# Altium project Cubli.PrjPcb (part 1 of 2)
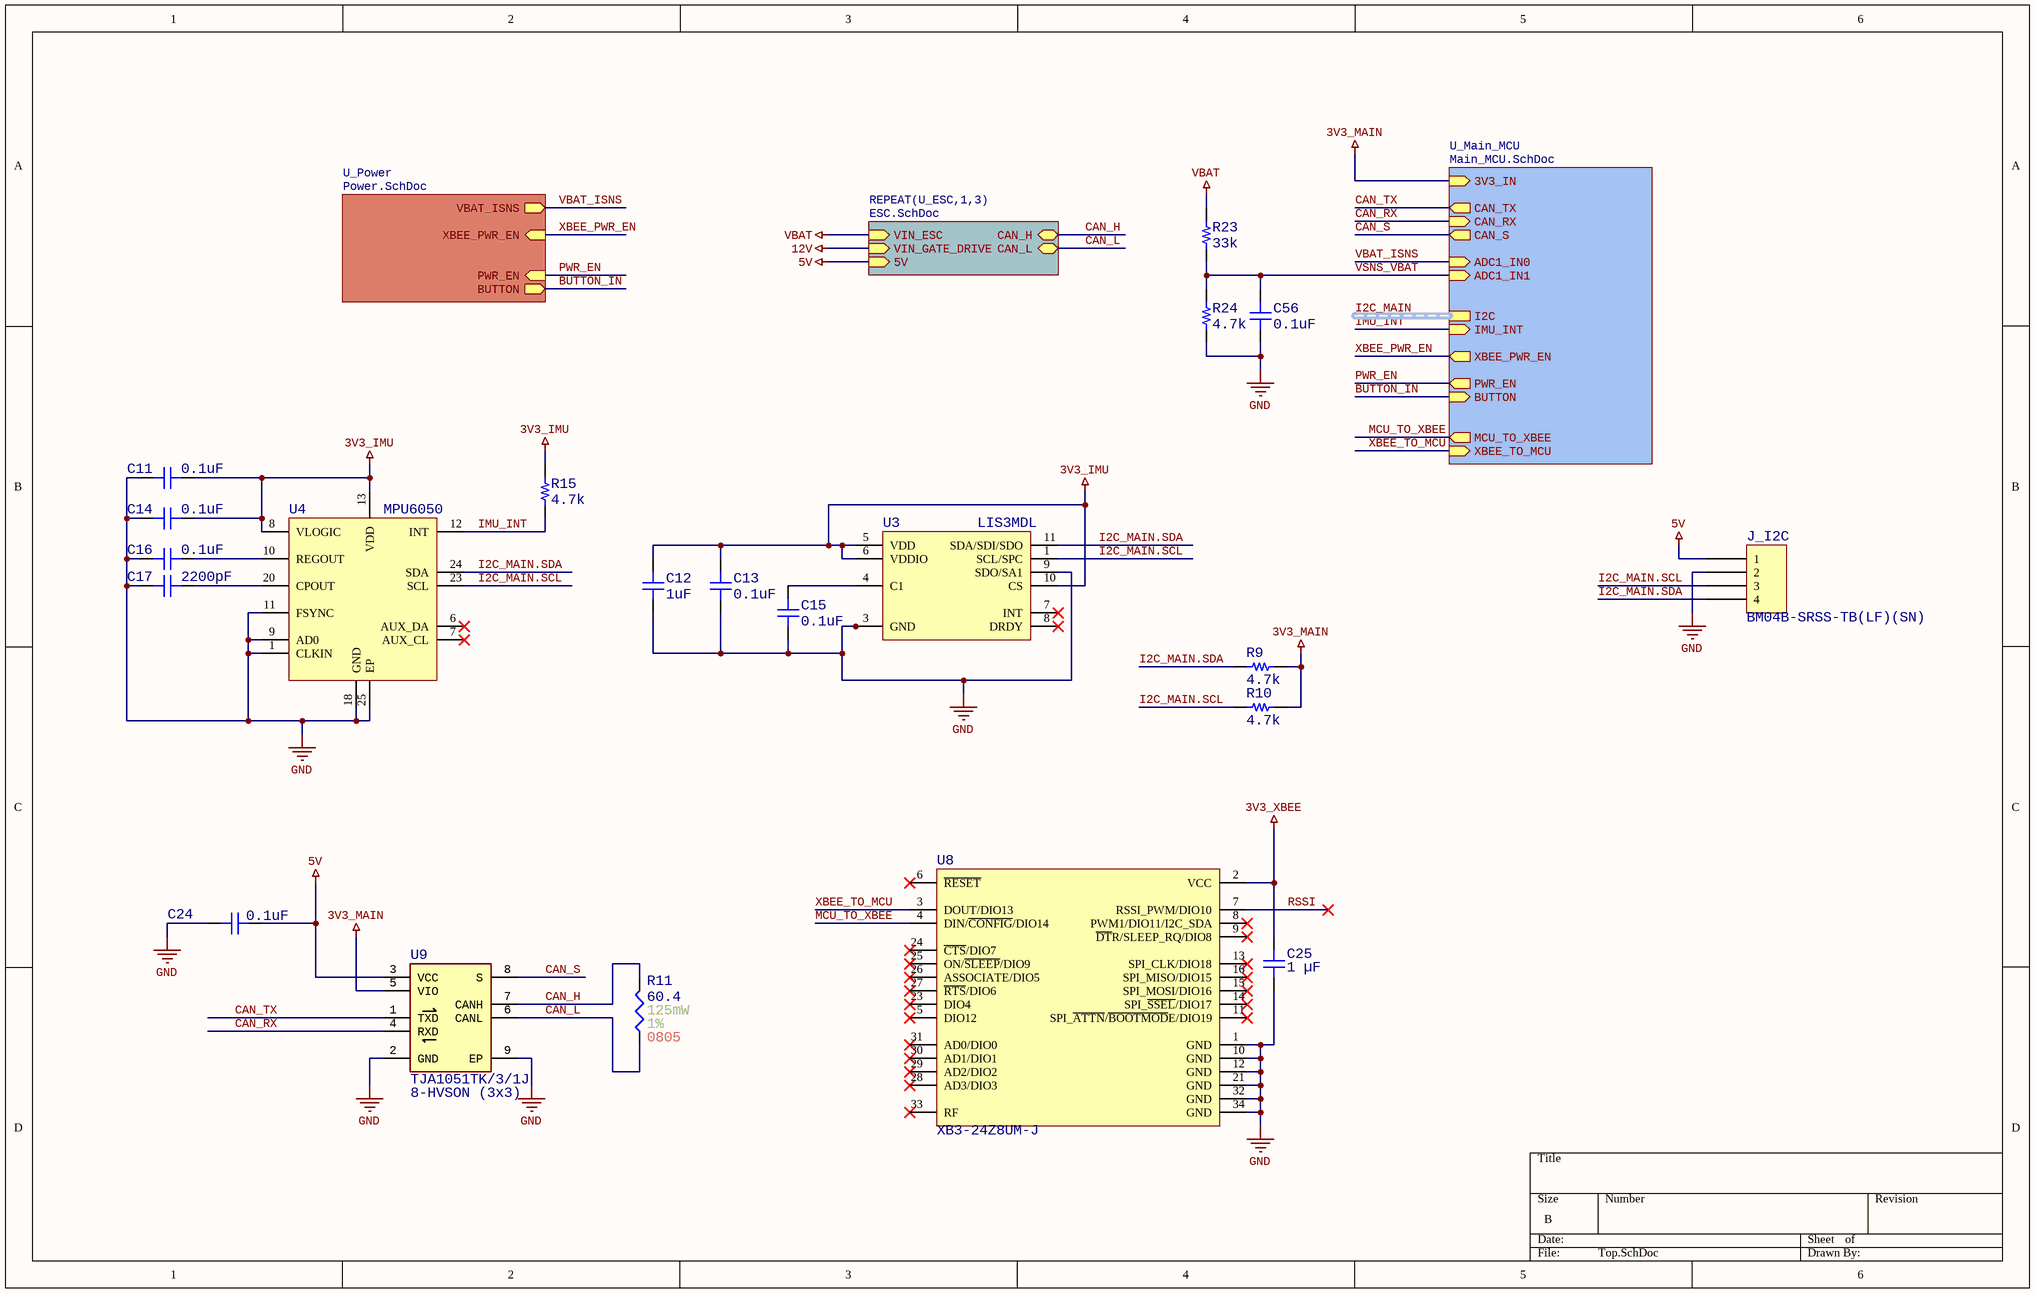
[diagram p0: Top.SchDoc]
Project: Cubli; ProjectRevision: 3.1
7 sheets, 473 parts. Net scope: hierarchical (ports join the sheet entries above them; power ports are global).
Board file: Cubli.PcbDoc
Sheets:
  Top.SchDoc
    U_ESC1 = ESC.SchDoc
      U_ESC_MCU = ESC_MCU.SchDoc
      U_Power = ESC_Power.SchDoc
      U_Half_Bridges = Half_Bridges.SchDoc
    U_ESC2 = ESC.SchDoc
      U_ESC_MCU = ESC_MCU.SchDoc
      U_Power = ESC_Power.SchDoc
      U_Half_Bridges = Half_Bridges.SchDoc
    U_ESC3 = ESC.SchDoc
      U_ESC_MCU = ESC_MCU.SchDoc
      U_Power = ESC_Power.SchDoc
      U_Half_Bridges = Half_Bridges.SchDoc
    U_Main_MCU = Main_MCU.SchDoc
    U_Power = Power.SchDoc

## Sheet Top.SchDoc
size B; SheetNumber: 1; SheetTotal: 7

### Parts
C11  0.1uF  [CAP_0402]
C12  1uF  [CAP_0402]
C13  0.1uF  [CAP_0402]
C14  0.1uF  [CAP_0402]
C15  0.1uF  [CAP_0402]
C16  0.1uF  [CAP_0402]
C17  2200pF  [CAP_0402]
C24  0.1uF  [CAP_0402]
C25  1 µF  [CAP 0402_1005]
C56  0.1uF  [CAP_0402]
J_I2C  BM04B-SRSS-TB(LF)(SN)  [JST BM04B-SRSS-TB]
R9  4.7k  [RES_0402]
R10  4.7k  [RES_0402]
R11  value 60.4  Power: 125mW  Tolerance: 1%  Case/Package: 0805  [0805 Resistor]  (hidden comment: TFA0805R60R4F-T5)
R15  4.7k  [RES_0402]
R23  33k  [RES_0402]
R24  4.7k  [RES_0402]
U3  LIS3MDL  [LGA12_ST]
U4  MPU6050  [IC_MPU6050]
U8  XB3-24Z8UM-J  [XCVR_XB3-24Z8UM-J]
U9  TJA1051TK/3/1J  Case/Package: 8-HVSON (3x3)  [TJA1044xxK]

### Sub-sheets
REPEAT(U_ESC,1,3) = ESC.SchDoc: CAN_H (bidir), CAN_L (bidir), VIN_ESC (in), VIN_GATE_DRIVE (in), 5V (in)
U_Main_MCU = Main_MCU.SchDoc: I2C (harness I2C), CAN_TX (out), CAN_RX (in), CAN_S (out), 3V3_IN (in), ADC1_IN0 (in), IMU_INT (in), XBEE_PWR_EN (out), PWR_EN (out), BUTTON (in), XBEE_TO_MCU (in), MCU_TO_XBEE (out), ADC1_IN1 (in)
U_Power = Power.SchDoc: XBEE_PWR_EN (in), VBAT_ISNS (out), PWR_EN (in), BUTTON (out)

### Nets
3V3_IMU: C11.1 C12.1 C13.1 C14.1 R15.1 U3.5(VDD) U3.6(VDDIO) U3.10(CS) U4.8(VLOGIC) U4.13(VDD)
3V3_MAIN: R9.1 R10.1 U9.5(VIO) ; sheet U_Main_MCU/3V3_IN
3V3_XBEE: C25.1 U8.2(VCC)
5V: C24.1 J_I2C.1 U9.3(VCC) ; sheet REPEAT(U_ESC,1,3)/5V
GND: C11.2 C12.2 C13.2 C14.2 C15.2 C16.2 C17.2 C24.2 C25.2 C56.2 J_I2C.2 R24.2 U3.2(Reserved) U3.3(GND) U3.9(SDO/SA1) U3.12(Reserved) U4.1(CLKIN) U4.9(AD0) U4.11(FSYNC) U4.18(GND) U4.25(EP) U8.1(GND) U8.10(GND) U8.12(GND) U8.21(GND) U8.32(GND) U8.34(GND) U9.2(GND) U9.9(EP)
VBAT: R23.1 ; sheet REPEAT(U_ESC,1,3)/VIN_ESC
BUTTON_IN: sheet U_Main_MCU/BUTTON, sheet U_Power/BUTTON
CAN_H: R11.2 U9.7(CANH) ; sheet REPEAT(U_ESC,1,3)/CAN_H
CAN_L: R11.1 U9.6(CANL) ; sheet REPEAT(U_ESC,1,3)/CAN_L
CAN_RX: U9.4(RXD) ; sheet U_Main_MCU/CAN_RX
CAN_S: U9.8(S) ; sheet U_Main_MCU/CAN_S
CAN_TX: U9.1(TXD) ; sheet U_Main_MCU/CAN_TX
I2C_MAIN.SCL: J_I2C.3 R10.2 U3.1(SCL/SPC) U4.23(SCL)
I2C_MAIN.SDA: J_I2C.4 R9.2 U3.11(SDA/SDI/SDO) U4.24(SDA)
IMU_INT: R15.2 U4.12(INT) ; sheet U_Main_MCU/IMU_INT
MCU_TO_XBEE: U8.4(DIN/~{CONFIG}/DIO14) ; sheet U_Main_MCU/MCU_TO_XBEE
PWR_EN: sheet U_Main_MCU/PWR_EN, sheet U_Power/PWR_EN
RSSI: U8.7(RSSI_PWM/DIO10)
VBAT_ISNS: sheet U_Main_MCU/ADC1_IN0, sheet U_Power/VBAT_ISNS
VSNS_VBAT: C56.1 R23.2 R24.1 ; sheet U_Main_MCU/ADC1_IN1
XBEE_PWR_EN: sheet U_Main_MCU/XBEE_PWR_EN, sheet U_Power/XBEE_PWR_EN
XBEE_TO_MCU: U8.3(DOUT/DIO13) ; sheet U_Main_MCU/XBEE_TO_MCU
NetC15_1: C15.1 U3.4(C1)
NetC16_1: C16.1 U4.10(REGOUT)
NetC17_1: C17.1 U4.20(CPOUT)

Not connected (* = marked no-connect by the designer): U3 7(INT)* 8(DRDY)*; U4 6(AUX_DA)* 7(AUX_CL)*; U8 5(DIO12)* 6(~{RESET})* 8(PWM1/DIO11/I2C_SDA)* 9(~{DT}R/SLEEP_RQ/DIO8)* 11(SPI_~{ATTN}/~{BOOTMOD}E/DIO19)* 13(SPI_CLK/DIO18)* 14(SPI_~{SSEL}/DIO17)* 15(SPI_MOSI/DIO16)* 16(SPI_MISO/DIO15)* 23(DIO4)* 24(~{CTS}/DIO7)* 25(ON/~{SLEEP}/DIO9)* 26(ASSOCIATE/DIO5)* 27(~{RTS}/DIO6)* 28(AD3/DIO3)* 29(AD2/DIO2)* 30(AD1/DIO1)* 31(AD0/DIO0)* 33(RF)*

### Buses and harness runs
harness I2C_MAIN = sheet U_Main_MCU/I2C

### Library data of the parts
C11-C17 C24 C56 = CAP_0402: CAP CER 402
  C11 C13-C16 C24 C56: Value: 0.1uF
  C12: Value: 1uF
  C17: Value: 2200pF
C25 = C0402C104K4RACAUTO: CAP CER 0.1UF 16V X7R 0402; manufacturer: KEMET; Capacitance: 0.1 µF; Tolerance: ±10%; Part Number: C0402C104K4RACAUTO; Value: 1 µF; Applications: Automotive, Bypass, Decoupling; componentlink1description: Datasheet; componentlink1url: https://api.kemet.com/component-edge/download/specsheet/C0402C104K4RACAUTO.pdf; componentlink2description: DigiKey Link; componentlink2url: https://www.digikey.com/en/products/detail/kemet/C0402C104K4RACAUTO/3314827; Device Package: 0402 (1005 Metric); lastupdated: 8/14/2022 9:05:51 PM; Lifecycle Status: Active; Minimum Order: 1; Mounting Type: Surface Mount, MLCC; Operating Temperature: -55°C ~ 125°C; Package / Case: 0402 (1005 Metric); packaging: TapeAndReel; partid: 3024; Part Status: Active; price: 0.01; Ratings: AEC-Q200; series: SMD Auto X7R; Size / Dimension: 0.039" L x 0.020" W (1.00mm x 0.50mm); Supplier 1: DigiKey; Supplier Part Number 1: 399-6828-1-ND; Temperature Coefficient: X7R; Thickness (Max): 0.022" (0.55mm); Voltage - Rated: 16V
J_I2C = BM04B-SRSS-TB(LF)(SN): CONN HEADER SMD 4POS 1MM; Manufacturer: JST Sales America Inc.; Current Rating (Amps): 0.7A; Material Flammability Rating: UL94 V-0; Number of Positions: 4; Number of Positions Loaded: All; Pitch - Mating: 0.039" (1.00mm); Row Spacing - Mating: -25°C ~ 85°C; Shrouding: Shrouded - 4 Wall; Style: Board to Cable/Wire; Voltage Rating: 50V; Part Number: BM04B-SRSS-TB(LF)(SN); ComponentLink1Description: Datasheet; ComponentLink1URL: http://www.jst-mfg.com/product/pdf/eng/eSH.pdf; ComponentLink2Description: DigiKey Link; ComponentLink2URL: http://digikey.com/product-detail/en/jst-sales-america-inc/BM04B-SRSS-TB-LF-SN/455-1790-1-ND/926861; Connector Type: Header; Contact Finish - Mating: Tin; Contact Finish - Post: Tin; Contact Material: Copper Alloy; Contact Shape: Square; Contact Type: Male Pin; Fastening Type: Push-Pull; Features: Solder Retention; Insulation Color: Natural; Insulation Height: 0.167" (4.25mm); Insulation Material: Polyamide (PA), Nylon; LastUpdated: 8/24/2020 1:45:53 PM; Lifecycle Status: Active; Minimum Order: 1; Mounting Type: Surface Mount; Number of Rows: 1; Operating Temperature: -25°C ~ 85°C; Packaging: TapeAndReel; PartId: 16; Part Status: Active; Price: 0.29; Series: SR; Supplier 1: DigiKey; Supplier Part Number 1: 455-1790-1-ND; Termination: Solder
R9 R10 R15 R23 R24 = RES_0402: RES 0402
R11 = CMP-009-00189-2: Res 60.4 Ohm 1% 1/8W 0805; AECQ: Yes; Manufacturer Part Number: TFA0805R60R4F-T5; Mounting Technology: SMD; Pins: 2
U3 = LIS3MDL: Magnetometer
U8 = XB3-24Z8UM-J: 802.15.4 Zigbee Transceiver Module 2.4GHz Antenna Not Included, U.FL Surface Mount; MF: Digi International; Availability: Unavailable; MP: XB3-24Z8UM-J; Value: *; SnapEDA_Link: https://www.snapeda.com/parts/XB3-24Z8UM-J/Digi%20International/view-part/2762908/?ref=snap; Price: None; Package: SMD-34 Digi International
U9 = CMP-031-00007-3: Interface Circuit, PDSO8; AECQ: Yes; Max Operating Temperature: 150°C; Pins: 8; Min Operating Temperature: -40°C

## Sheet ESC.SchDoc
size B; DocumentNumber: 5; Revision: 1.1; SheetNumber: 4; SheetTotal: 7
Used 3 times, as channels U_ESC1, U_ESC2, U_ESC3. Parts and nets are listed once, with the designators drawn on the sheet.
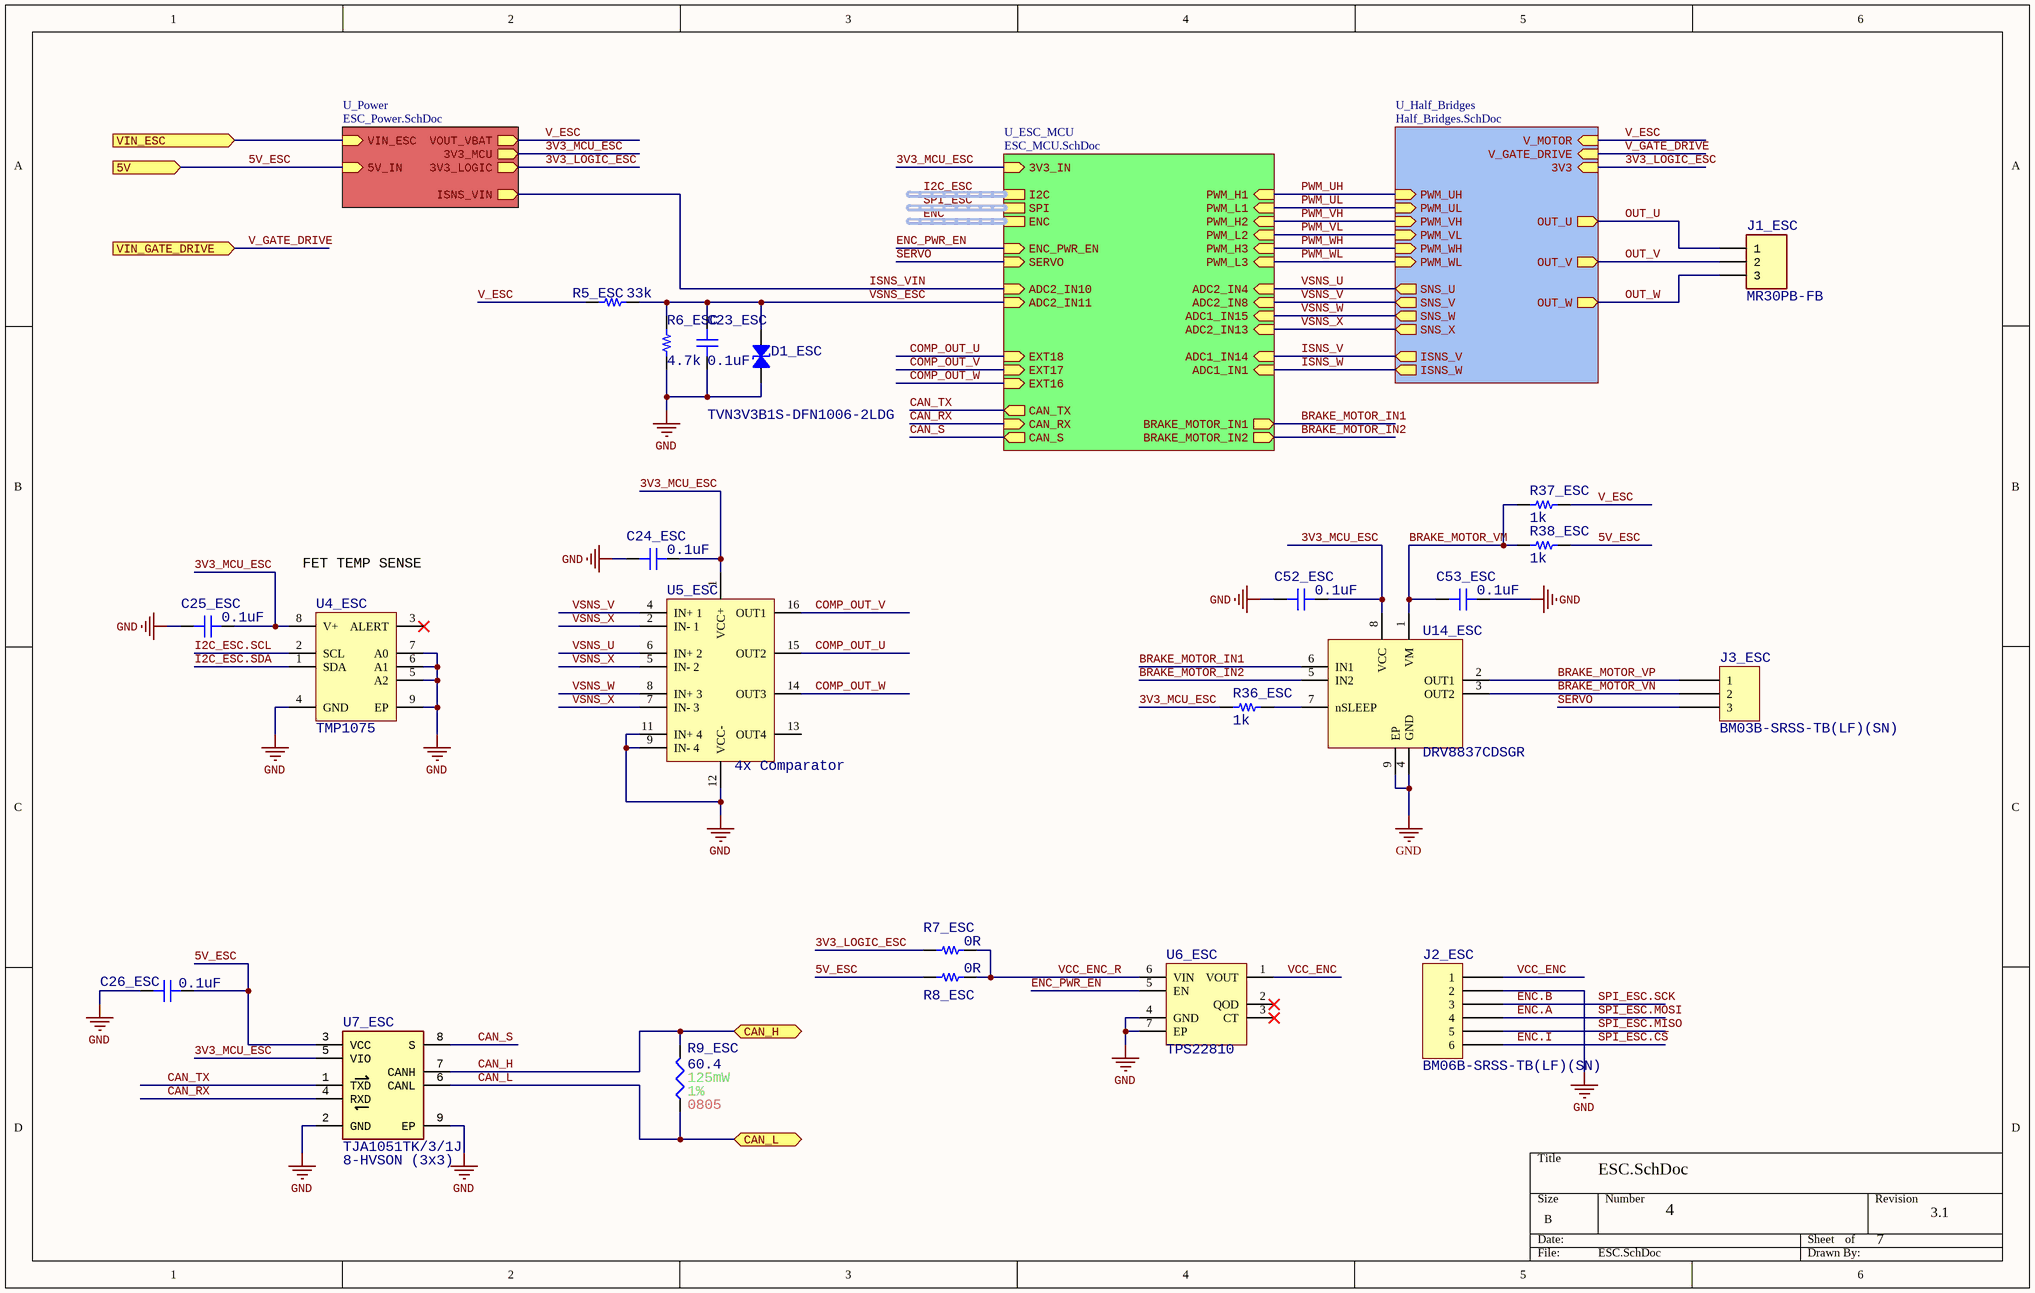
[diagram p1: ESC.SchDoc]

### Parts
C23_ESC  0.1uF  [CAP_0402]
C24_ESC  0.1uF  [CAP_0402]
C25_ESC  0.1uF  [CAP_0402]
C26_ESC  0.1uF  [CAP_0402]
C52_ESC  0.1uF  [CAP_0402]
C53_ESC  0.1uF  [CAP_0402]
D1_ESC  TVN3V3B1S-DFN1006-2LDG  [0402]
J1_ESC  MR30PB-FB  [MR30PB-F]
J2_ESC  BM06B-SRSS-TB(LF)(SN)  [JST BM06B-SRSS-TB]
J3_ESC  BM03B-SRSS-TB(LF)(SN)  [JST BM03B-SRSS-TB]
R5_ESC  33k  [RES_0402]
R6_ESC  4.7k  [RES_0402]
R7_ESC  0R  [RES_0402]
R8_ESC  0R  [RES_0402]
R9_ESC  value 60.4  Power: 125mW  Tolerance: 1%  Case/Package: 0805  [0805 Resistor]  (hidden comment: TFA0805R60R4F-T5)
R36_ESC  1k  [RES_0402]
R37_ESC  1k  [RES_0402]
R38_ESC  1k  [RES_0402]
U4_ESC  TMP1075  [8-WSON_2x2_0.5mm]
U5_ESC  4x Comparator  [QFN50P300X300X100-16N]
U6_ESC  TPS22810  [6-WSON_2x2_0.65mm]
U7_ESC  TJA1051TK/3/1J  Case/Package: 8-HVSON (3x3)  [TJA1044xxK]
U14_ESC  DRV8837CDSGR  [SON50P200X200X80-9N]

### Sub-sheets
U_ESC_MCU = ESC_MCU.SchDoc: I2C (harness I2C), PWM_L1 (in), PWM_H1 (in), PWM_L2 (in), PWM_H2 (in), PWM_L3 (in), PWM_H3 (in), ENC (harness ENC), ADC1_IN1 (in), ADC1_IN14 (in), EXT16 (in), EXT17 (in), EXT18 (in), ADC2_IN10 (in), SPI (harness SPI), ENC_PWR_EN (in), ADC2_IN11 (in), ADC2_IN4 (in), ADC2_IN8 (in), ADC2_IN13 (in), ADC1_IN15 (in), SERVO (in), CAN_TX (out), CAN_RX (in), CAN_S (out), 3V3_IN (in), BRAKE_MOTOR_IN1 (out), BRAKE_MOTOR_IN2 (out)
U_Half_Bridges = Half_Bridges.SchDoc: PWM_UH (in), PWM_UL (in), PWM_VH (in), PWM_VL (in), PWM_WH (in), PWM_WL (in), SNS_U (out), SNS_V (out), SNS_W (out), SNS_X (out), OUT_U (out), OUT_V (out), OUT_W (out), ISNS_V (out), ISNS_W (out), V_MOTOR (in), V_GATE_DRIVE (in), 3V3 (in)
U_Power = ESC_Power.SchDoc: ISNS_VIN (out), VIN_ESC (in), VOUT_VBAT (out), 5V_IN (in), 3V3_MCU (out), 3V3_LOGIC (out)

### Ports
5V (in), CAN_H (bidir), CAN_L (bidir), VIN_ESC (in), VIN_GATE_DRIVE (in)

### Nets
GND: C23_ESC.1 C24_ESC.1 C25_ESC.1 C26_ESC.2 C52_ESC.1 C53_ESC.2 D1_ESC.1 J2_ESC.2 R6_ESC.2 U4_ESC.4(GND) U4_ESC.5(A2) U4_ESC.6(A1) U4_ESC.7(A0) U4_ESC.9(EP) U5_ESC.9(IN-_4) U5_ESC.11(IN+_4) U5_ESC.12(VCC-) U6_ESC.4(GND) U6_ESC.7(EP) U7_ESC.2(GND) U7_ESC.9(EP) U14_ESC.4(GND) U14_ESC.9(EP)
3V3_LOGIC_ESC: R7_ESC.2 ; sheet U_Power/3V3_LOGIC, sheet U_Half_Bridges/3V3
3V3_MCU_ESC: C24_ESC.2 C25_ESC.2 C52_ESC.2 R36_ESC.1 U4_ESC.8(V+) U5_ESC.1(VCC+) U7_ESC.5(VIO) U14_ESC.8(VCC) ; sheet U_ESC_MCU/3V3_IN, sheet U_Power/3V3_MCU
5V_ESC: C26_ESC.1 R8_ESC.2 R38_ESC.2 U7_ESC.3(VCC) ; port 5V, sheet U_Power/5V_IN
BRAKE_MOTOR_IN1: U14_ESC.6(IN1) ; sheet U_ESC_MCU/BRAKE_MOTOR_IN1
BRAKE_MOTOR_IN2: U14_ESC.5(IN2) ; sheet U_ESC_MCU/BRAKE_MOTOR_IN2
BRAKE_MOTOR_VM: C53_ESC.1 R37_ESC.1 R38_ESC.1 U14_ESC.1(VM)
BRAKE_MOTOR_VN: J3_ESC.2 U14_ESC.3(OUT2)
BRAKE_MOTOR_VP: J3_ESC.1 U14_ESC.2(OUT1)
CAN_H: R9_ESC.2 U7_ESC.7(CANH) ; port CAN_H
CAN_L: R9_ESC.1 U7_ESC.6(CANL) ; port CAN_L
CAN_RX: U7_ESC.4(RXD) ; sheet U_ESC_MCU/CAN_RX
CAN_S: U7_ESC.8(S) ; sheet U_ESC_MCU/CAN_S
CAN_TX: U7_ESC.1(TXD) ; sheet U_ESC_MCU/CAN_TX
COMP_OUT_U: U5_ESC.15(OUT2) ; sheet U_ESC_MCU/EXT18
COMP_OUT_V: U5_ESC.16(OUT1) ; sheet U_ESC_MCU/EXT17
COMP_OUT_W: U5_ESC.14(OUT3) ; sheet U_ESC_MCU/EXT16
ENC.A: J2_ESC.4  [also labelled SPI_ESC.MOSI]
ENC.B: J2_ESC.3  [also labelled SPI_ESC.SCK]
ENC.I: J2_ESC.6  [also labelled SPI_ESC.~{CS}]
ENC_PWR_EN: U6_ESC.5(EN) ; sheet U_ESC_MCU/ENC_PWR_EN
I2C_ESC.SCL: U4_ESC.2(SCL)
I2C_ESC.SDA: U4_ESC.1(SDA)
ISNS_V: sheet U_ESC_MCU/ADC1_IN14, sheet U_Half_Bridges/ISNS_V
ISNS_VIN: sheet U_ESC_MCU/ADC2_IN10, sheet U_Power/ISNS_VIN
ISNS_W: sheet U_ESC_MCU/ADC1_IN1, sheet U_Half_Bridges/ISNS_W
OUT_U: J1_ESC.1 ; sheet U_Half_Bridges/OUT_U
OUT_V: J1_ESC.2 ; sheet U_Half_Bridges/OUT_V
OUT_W: J1_ESC.3 ; sheet U_Half_Bridges/OUT_W
PWM_UH: sheet U_ESC_MCU/PWM_H1, sheet U_Half_Bridges/PWM_UH
PWM_UL: sheet U_ESC_MCU/PWM_L1, sheet U_Half_Bridges/PWM_UL
PWM_VH: sheet U_ESC_MCU/PWM_H2, sheet U_Half_Bridges/PWM_VH
PWM_VL: sheet U_ESC_MCU/PWM_L2, sheet U_Half_Bridges/PWM_VL
PWM_WH: sheet U_ESC_MCU/PWM_H3, sheet U_Half_Bridges/PWM_WH
PWM_WL: sheet U_ESC_MCU/PWM_L3, sheet U_Half_Bridges/PWM_WL
SERVO: J3_ESC.3 ; sheet U_ESC_MCU/SERVO
SPI_ESC.MISO: J2_ESC.5
V_ESC: R5_ESC.2 R37_ESC.2 ; sheet U_Power/VOUT_VBAT, sheet U_Half_Bridges/V_MOTOR
V_GATE_DRIVE: port VIN_GATE_DRIVE, sheet U_Half_Bridges/V_GATE_DRIVE
VCC_ENC: J2_ESC.1 U6_ESC.1(VOUT)
VCC_ENC_R: R7_ESC.1 R8_ESC.1 U6_ESC.6(VIN)
VIN_ESC: port VIN_ESC, sheet U_Power/VIN_ESC
VSNS_ESC: C23_ESC.2 D1_ESC.2 R5_ESC.1 R6_ESC.1 ; sheet U_ESC_MCU/ADC2_IN11
VSNS_U: U5_ESC.6(IN+_2) ; sheet U_ESC_MCU/ADC2_IN4, sheet U_Half_Bridges/SNS_U
VSNS_V: U5_ESC.4(IN+_1) ; sheet U_ESC_MCU/ADC2_IN8, sheet U_Half_Bridges/SNS_V
VSNS_W: U5_ESC.8(IN+_3) ; sheet U_ESC_MCU/ADC1_IN15, sheet U_Half_Bridges/SNS_W
VSNS_X: U5_ESC.2(IN-_1) U5_ESC.5(IN-_2) U5_ESC.7(IN-_3) ; sheet U_ESC_MCU/ADC2_IN13, sheet U_Half_Bridges/SNS_X
NetR36_ESC_2: R36_ESC.2 U14_ESC.7(nSLEEP)

Not connected (* = marked no-connect by the designer): U4_ESC 3(ALERT)*; U5_ESC 13(OUT4); U6_ESC 2(QOD)* 3(CT)*

### Channels
U_ESC1: designators end in _1; ports 5V=5V CAN_H=CAN_H CAN_L=CAN_L VIN_ESC=VBAT VIN_GATE_DRIVE=12V
U_ESC2: designators end in _2; ports 5V=5V CAN_H=CAN_H CAN_L=CAN_L VIN_ESC=VBAT VIN_GATE_DRIVE=12V
U_ESC3: designators end in _3; ports 5V=5V CAN_H=CAN_H CAN_L=CAN_L VIN_ESC=VBAT VIN_GATE_DRIVE=12V

### Buses and harness runs
harness ENC = sheet U_ESC_MCU/ENC
harness I2C_ESC = sheet U_ESC_MCU/I2C
harness SPI_ESC = sheet U_ESC_MCU/SPI

### Notes on the sheet
- FET TEMP SENSE

### Library data of the parts
C23_ESC C24_ESC C25_ESC C26_ESC C52_ESC C53_ESC = CAP_0402: CAP CER 402; Value: 0.1uF
D1_ESC = TVN3V3B1S-DFN1006-2LDG: TVS DIODE 3.3V 14.2PF DFN1006; Manufacturer: INPAQ Technology Co., Ltd; Bidirectional Channels: 1; Capacitance @ Frequency: 11.5pF @ 1MHz; Current - Peak Pulse (10/1000µs): 8A (8/20µs); Power Line Protection: No; Type: Zener; Voltage - Breakdown (Min): 4V; Voltage - Clamping (Max) @ Ipp: 6.6V (Typ); Voltage - Reverse Standoff (Typ): 3.3V (Max); Part Number: TVN3V3B1S-DFN1006-2LDG; Applications: General Purpose; ComponentLink1Description: Datasheet; ComponentLink1URL: https://mm.digikey.com/Volume0/opasdata/d220001/medias/docus/5383/TVN3V3B1S-DFN1006-2LDG.pdf; ComponentLink2Description: DigiKey Link; ComponentLink2URL: https://www.digikey.com/en/products/detail/inpaq-technology-co-ltd/TVN3V3B1S-DFN1006-2LDG/20486686; Device Package: 0402 (1005 Metric); LastUpdated: 6/3/2024 8:22:57 PM; Lifecycle Status: Active; Minimum Order: 1; Mounting Type: Surface Mount; Operating Temperature: 150°C (TJ); Package / Case: 0402 (1005 Metric); Packaging: TapeAndReel; PartId: 11821; Price: 0.02; Series: TVN; Supplier 1: DigiKey; Supplier Part Number 1: 3526-TVN3V3B1S-DFN1006-2LDGCT-ND; Supplier Device Package: DFN1006
J1_ESC = CMP-002-00125-1: Vertical 3 pin barrel connector; Manufacturer: Amass; Gender: Female; Max Current Rating: 30A; Pins: 3
J2_ESC = BM06B-SRSS-TB(LF)(SN): CONN HEADER SMD 6POS 1MM; Manufacturer: JST Sales America Inc.; Current Rating (Amps): 0.7A; Material Flammability Rating: UL94 V-0; Number of Positions: 6; Number of Positions Loaded: All; Pitch - Mating: 0.039" (1.00mm); Shrouding: Shrouded - 4 Wall; Style: Board to Cable/Wire; Voltage Rating: 50V; Part Number: BM06B-SRSS-TB(LF)(SN); ComponentLink1Description: Datasheet; ComponentLink1URL: http://www.jst-mfg.com/product/pdf/eng/eSH.pdf; ComponentLink2Description: DigiKey Link; ComponentLink2URL: http://digikey.com/product-detail/en/jst-sales-america-inc/BM06B-SRSS-TB-LF-SN/455-1792-1-ND/926863; Connector Type: Header; Contact Finish - Mating: Tin; Contact Finish - Post: Tin; Contact Material: Copper Alloy; Contact Shape: Square; Contact Type: Male Pin; Fastening Type: Push-Pull; Features: Solder Retention; Insulation Color: Natural; Insulation Height: 0.167" (4.25mm); Insulation Material: Polyamide (PA), Nylon; LastUpdated: 1/12/2020 10:14:30 PM; Lifecycle Status: Active; Minimum Order: 1; Mounting Type: Surface Mount; Number of Rows: 1; Operating Temperature: -25°C ~ 85°C; Packaging: TapeAndReel; PartId: 20; Part Status: Active; Price: 0.38; Series: SR; Supplier 1: DigiKey; Supplier Part Number 1: 455-1792-1-ND; Termination: Solder
J3_ESC = BM03B-SRSS-TB(LF)(SN): CONN HEADER SMD 3POS 1MM; Manufacturer: JST Sales America Inc.; Current Rating (Amps): 0.7A; Material Flammability Rating: UL94 V-0; Number of Positions: 3; Number of Positions Loaded: All; Pitch - Mating: 0.039" (1.00mm); Shrouding: Shrouded - 4 Wall; Style: Board to Cable/Wire; Voltage Rating: 50V; Part Number: BM03B-SRSS-TB(LF)(SN); ComponentLink1Description: Datasheet; ComponentLink1URL: http://www.jst-mfg.com/product/pdf/eng/eSR.pdf; ComponentLink2Description: DigiKey Link; ComponentLink2URL: http://digikey.com/product-detail/en/jst-sales-america-inc/BM03B-SRSS-TB-LF-SN/455-1789-1-ND/926860; Connector Type: Header; Contact Finish - Mating: Tin; Contact Finish - Post: Tin; Contact Material: Copper Alloy; Contact Shape: Square; Contact Type: Male Pin; Fastening Type: Push-Pull; Features: Solder Retention; Insulation Color: Natural; Insulation Height: 0.167" (4.25mm); Insulation Material: Polyamide (PA), Nylon; LastUpdated: 1/12/2020 10:12:14 PM; Lifecycle Status: Active; Minimum Order: 1; Mounting Type: Surface Mount; Number of Rows: 1; Operating Temperature: -25°C ~ 85°C; Packaging: TapeAndReel; PartId: 14; Part Status: Active; Price: 0.24; Series: SR; Supplier 1: DigiKey; Supplier Part Number 1: 455-1789-1-ND; Termination: Solder
R5_ESC R6_ESC R7_ESC R8_ESC R36_ESC R37_ESC R38_ESC = RES_0402: RES 0402
R9_ESC = CMP-009-00189-2: Res 60.4 Ohm 1% 1/8W 0805; AECQ: Yes; Manufacturer Part Number: TFA0805R60R4F-T5; Mounting Technology: SMD; Pins: 2
U4_ESC = TMP1075: I2C TEMP SENSOR
U5_ESC = LM2901Q4T: Comparator General Purpose CMOS, DTL, MOS, Open-Collector, TTL 16-QFN (3x3)
U6_ESC = TPS22810DRVR: Load switch TPS22810DRVR
U7_ESC = CMP-031-00007-3: Interface Circuit, PDSO8; AECQ: Yes; Max Operating Temperature: 150°C; Pins: 8; Min Operating Temperature: -40°C
U14_ESC = DRV8837CDSGR: 11-V, 1-A H-bridge motor driver 8-WSON -40 to 85; MF: Texas Instruments; Mouser-Purchase-URL: https://snapeda.com/shop?store=Mouser&id=617854; Value: *; DigiKey-Purchase-URL: https://snapeda.com/shop?store=DigiKey&id=617854; Package: WSON-8 Texas Instruments; Texas_Instruments-Purchase-URL: https://snapeda.com/shop?store=Texas+Instruments&id=617854; Price: None; MP: DRV8837CDSGR; SnapEDA_Link: https://www.snapeda.com/parts/DRV8837CDSGR/Texas%20Instruments/view-part/617854/?ref=snap; Availability: Good

## Sheet ESC_MCU.SchDoc
size B; DocumentNumber: 3; SheetNumber: 5; SheetTotal: 7
Used 3 times, as channels U_ESC1/U_ESC_MCU, U_ESC2/U_ESC_MCU, U_ESC3/U_ESC_MCU. Parts and nets are listed once, with the designators drawn on the sheet.
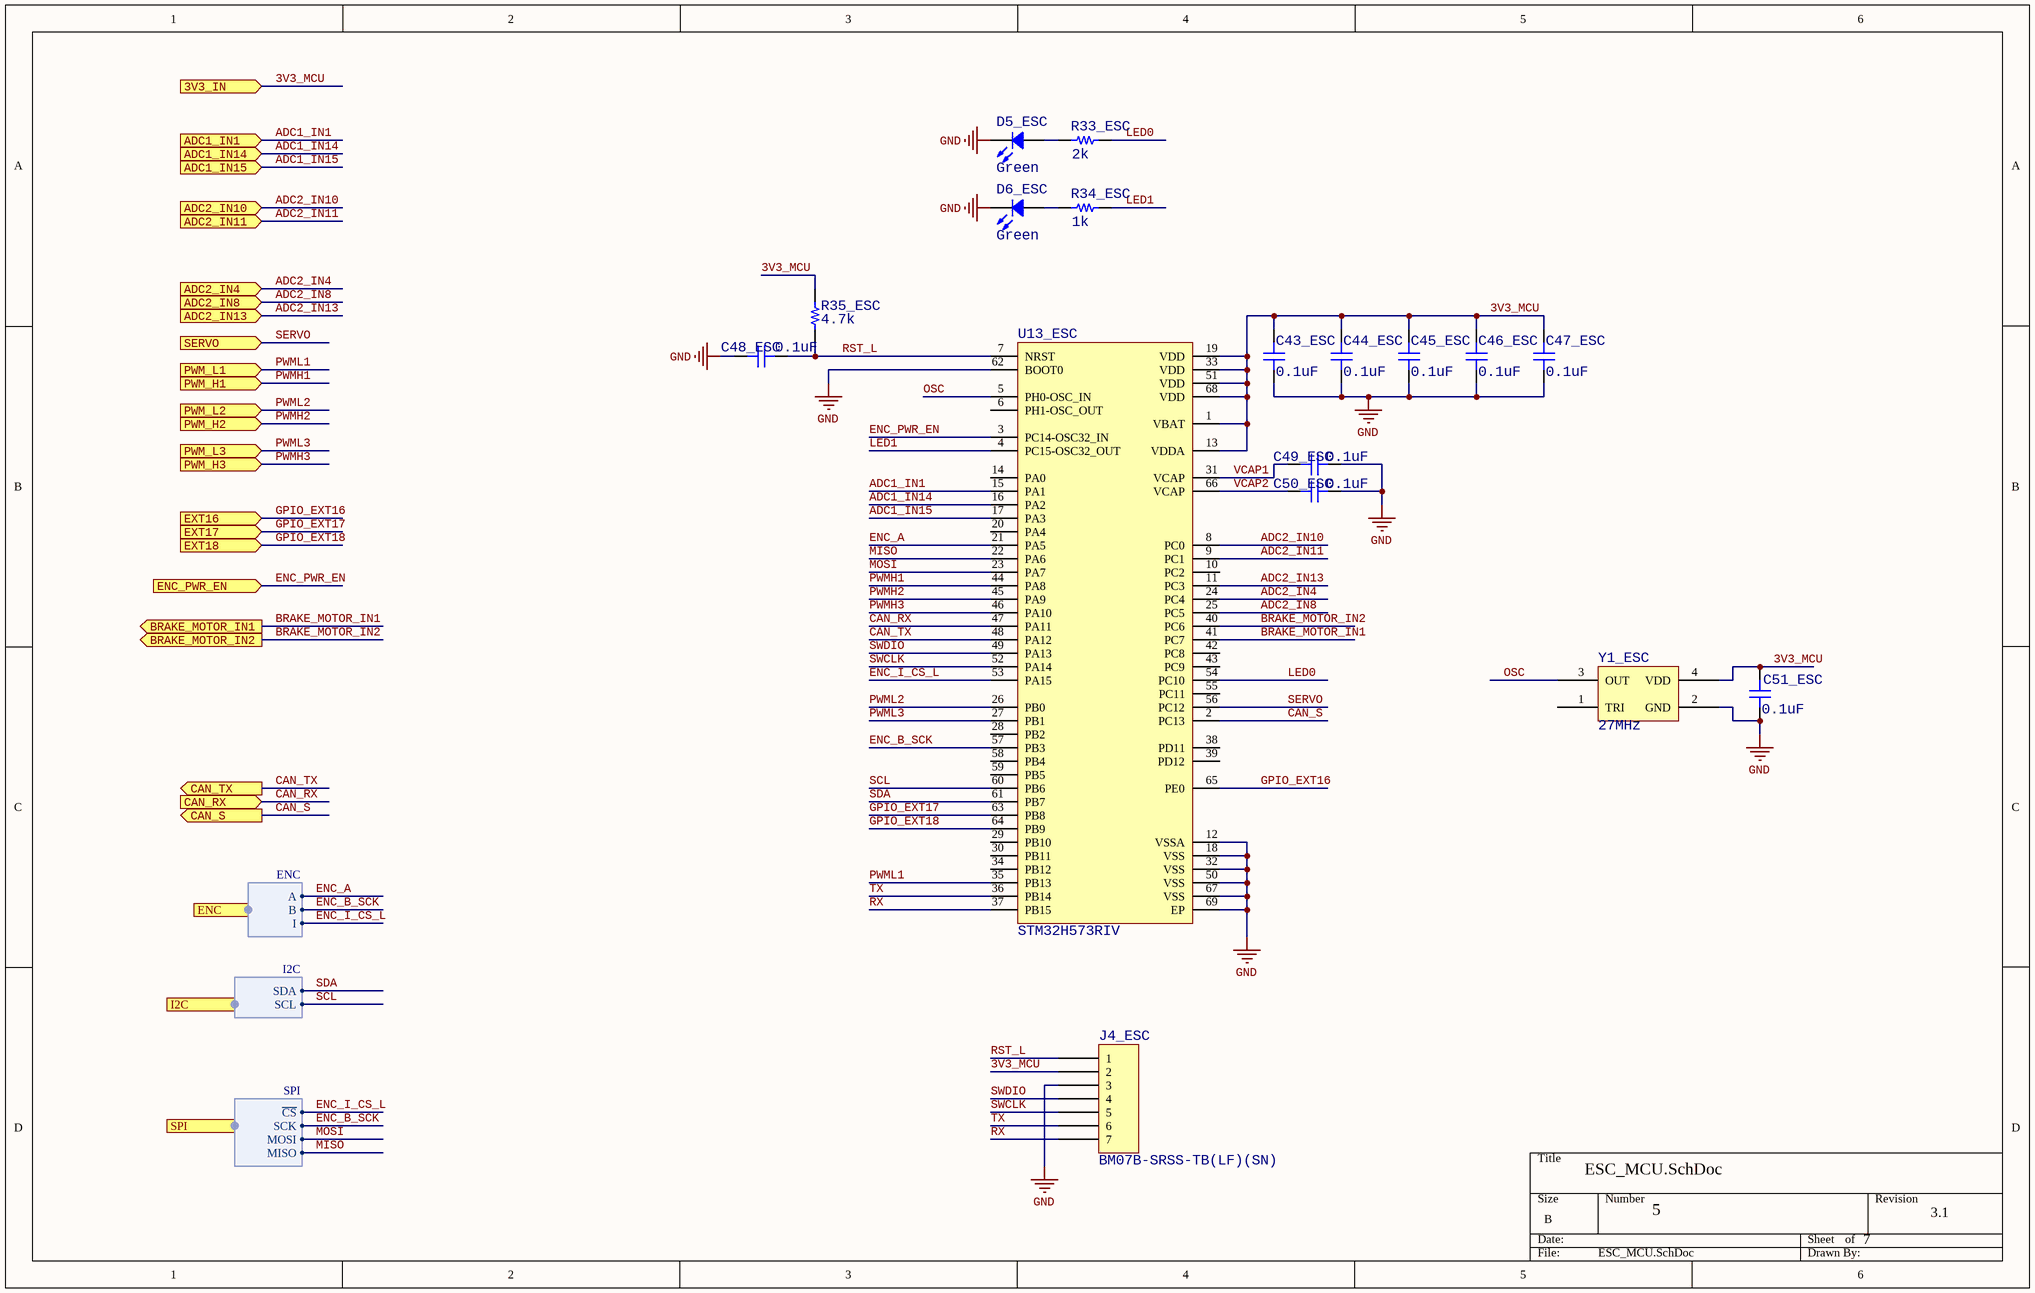
[diagram p2: ESC_MCU.SchDoc]

### Parts
C43_ESC  0.1uF  [CAP_0402]
C44_ESC  0.1uF  [CAP_0402]
C45_ESC  0.1uF  [CAP_0402]
C46_ESC  0.1uF  [CAP_0402]
C47_ESC  0.1uF  [CAP_0402]
C48_ESC  0.1uF  [CAP_0402]
C49_ESC  0.1uF  [CAP_0402]
C50_ESC  0.1uF  [CAP_0402]
C51_ESC  0.1uF  [CAP_0402]
D5_ESC  Green  [LED 0603_1608 GREEN]
D6_ESC  Green  [LED 0603_1608 GREEN]
J4_ESC  BM07B-SRSS-TB(LF)(SN)  [JST BM07B-SRSS-TB]
R33_ESC  2k  [RES_0402]
R34_ESC  1k  [RES_0402]
R35_ESC  4.7k  [RES_0402]
U13_ESC  STM32H573RIV  [68-VFQFPN]
Y1_ESC  27MHz  [ABRACON ASD]

### Ports
3V3_IN (in), ADC1_IN1 (in), ADC1_IN14 (in), ADC1_IN15 (in), ADC2_IN4 (in), ADC2_IN8 (in), ADC2_IN10 (in), ADC2_IN11 (in), ADC2_IN13 (in), BRAKE_MOTOR_IN1 (out), BRAKE_MOTOR_IN2 (out), CAN_RX (in), CAN_S (out), CAN_TX (out), ENC (harness ENC), ENC_PWR_EN (in), EXT16 (in), EXT17 (in), EXT18 (in), I2C (harness I2C), PWM_H1 (in), PWM_H2 (in), PWM_H3 (in), PWM_L1 (in), PWM_L2 (in), PWM_L3 (in), SERVO (in), SPI (harness SPI)

### Harnesses
I2C: SDA, SCL
ENC: A, B, I
SPI: ~{CS}, SCK, MOSI, MISO

### Nets
GND: C43_ESC.1 C44_ESC.1 C45_ESC.1 C46_ESC.1 C47_ESC.1 C48_ESC.2 C49_ESC.1 C50_ESC.1 C51_ESC.1 D5_ESC.2 D6_ESC.2 J4_ESC.3 U13_ESC.12(VSSA) U13_ESC.18(VSS) U13_ESC.32(VSS) U13_ESC.50(VSS) U13_ESC.62(BOOT0) U13_ESC.67(VSS) U13_ESC.69(EP) Y1_ESC.2(GND)
3V3_MCU: C43_ESC.2 C44_ESC.2 C45_ESC.2 C46_ESC.2 C47_ESC.2 C51_ESC.2 J4_ESC.2 R35_ESC.2 U13_ESC.1(VBAT) U13_ESC.13(VDDA) U13_ESC.19(VDD) U13_ESC.33(VDD) U13_ESC.51(VDD) U13_ESC.68(VDD) Y1_ESC.4(VDD) ; port 3V3_IN
ADC1_IN1: U13_ESC.15(PA1) ; port ADC1_IN1
ADC1_IN14: U13_ESC.16(PA2) ; port ADC1_IN14
ADC1_IN15: U13_ESC.17(PA3) ; port ADC1_IN15
ADC2_IN4: U13_ESC.24(PC4) ; port ADC2_IN4
ADC2_IN8: U13_ESC.25(PC5) ; port ADC2_IN8
ADC2_IN10: U13_ESC.8(PC0) ; port ADC2_IN10
ADC2_IN11: U13_ESC.9(PC1) ; port ADC2_IN11
ADC2_IN13: U13_ESC.11(PC3) ; port ADC2_IN13
BRAKE_MOTOR_IN1: U13_ESC.41(PC7) ; port BRAKE_MOTOR_IN1
BRAKE_MOTOR_IN2: U13_ESC.40(PC6) ; port BRAKE_MOTOR_IN2
CAN_RX: U13_ESC.47(PA11) ; port CAN_RX
CAN_S: U13_ESC.2(PC13) ; port CAN_S
CAN_TX: U13_ESC.48(PA12) ; port CAN_TX
ENC_A: U13_ESC.21(PA5) ; port ENC.A
ENC_B_SCK: U13_ESC.57(PB3) ; port ENC.B, port SPI.SCK
ENC_I_CS_L: U13_ESC.53(PA15) ; port ENC.I, port SPI.~{CS}
ENC_PWR_EN: U13_ESC.3(PC14-OSC32_IN) ; port ENC_PWR_EN
GPIO_EXT16: U13_ESC.65(PE0) ; port EXT16
GPIO_EXT17: U13_ESC.63(PB8) ; port EXT17
GPIO_EXT18: U13_ESC.64(PB9) ; port EXT18
LED0: R33_ESC.2 U13_ESC.54(PC10)
LED1: R34_ESC.2 U13_ESC.4(PC15-OSC32_OUT)
MISO: U13_ESC.22(PA6) ; port SPI.MISO
MOSI: U13_ESC.23(PA7) ; port SPI.MOSI
OSC: U13_ESC.5(PH0-OSC_IN) Y1_ESC.3(OUT)
PWMH1: U13_ESC.44(PA8) ; port PWM_H1
PWMH2: U13_ESC.45(PA9) ; port PWM_H2
PWMH3: U13_ESC.46(PA10) ; port PWM_H3
PWML1: U13_ESC.35(PB13) ; port PWM_L1
PWML2: U13_ESC.26(PB0) ; port PWM_L2
PWML3: U13_ESC.27(PB1) ; port PWM_L3
RST_L: C48_ESC.1 J4_ESC.1 R35_ESC.1 U13_ESC.7(NRST)
RX: J4_ESC.7 U13_ESC.37(PB15)
SCL: U13_ESC.60(PB6) ; port I2C.SCL
SDA: U13_ESC.61(PB7) ; port I2C.SDA
SERVO: U13_ESC.56(PC12) ; port SERVO
SWCLK: J4_ESC.5 U13_ESC.52(PA14)
SWDIO: J4_ESC.4 U13_ESC.49(PA13)
TX: J4_ESC.6 U13_ESC.36(PB14)
VCAP1: C49_ESC.2 U13_ESC.31(VCAP)
VCAP2: C50_ESC.2 U13_ESC.66(VCAP)
NetD5_ESC_1: D5_ESC.1 R33_ESC.1
NetD6_ESC_1: D6_ESC.1 R34_ESC.1

Not connected (* = marked no-connect by the designer): U13_ESC 6(PH1-OSC_OUT) 10(PC2) 14(PA0) 20(PA4) 28(PB2) 29(PB10) 30(PB11) 34(PB12) 38(PD11) 39(PD12) 42(PC8) 43(PC9) 55(PC11) 58(PB4) 59(PB5); Y1_ESC 1(TRI)

### Channels
U_ESC1/U_ESC_MCU: designators end in _1; ports 3V3_IN=3V3_MCU_ESC_U_ESC1 ADC1_IN1=ISNS_W_U_ESC1 ADC1_IN14=ISNS_V_U_ESC1 ADC1_IN15=VSNS_W_U_ESC1 ADC2_IN4=VSNS_U_U_ESC1 ADC2_IN8=VSNS_V_U_ESC1 ADC2_IN10=ISNS_VIN_U_ESC1 ADC2_IN11=VSNS_ESC_U_ESC1 ADC2_IN13=VSNS_X_U_ESC1 BRAKE_MOTOR_IN1=BRAKE_MOTOR_IN1_U_ESC1 BRAKE_MOTOR_IN2=BRAKE_MOTOR_IN2_U_ESC1 CAN_RX=CAN_RX_U_ESC1 CAN_S=CAN_S_U_ESC1 CAN_TX=CAN_TX_U_ESC1 ENC_PWR_EN=ENC_PWR_EN_U_ESC1 EXT16=COMP_OUT_W_U_ESC1 EXT17=COMP_OUT_V_U_ESC1 EXT18=COMP_OUT_U_U_ESC1 PWM_H1=PWM_UH_U_ESC1 PWM_H2=PWM_VH_U_ESC1 PWM_H3=PWM_WH_U_ESC1 PWM_L1=PWM_UL_U_ESC1 PWM_L2=PWM_VL_U_ESC1 PWM_L3=PWM_WL_U_ESC1 SERVO=SERVO_U_ESC1
U_ESC2/U_ESC_MCU: designators end in _2; ports 3V3_IN=3V3_MCU_ESC_U_ESC2 ADC1_IN1=ISNS_W_U_ESC2 ADC1_IN14=ISNS_V_U_ESC2 ADC1_IN15=VSNS_W_U_ESC2 ADC2_IN4=VSNS_U_U_ESC2 ADC2_IN8=VSNS_V_U_ESC2 ADC2_IN10=ISNS_VIN_U_ESC2 ADC2_IN11=VSNS_ESC_U_ESC2 ADC2_IN13=VSNS_X_U_ESC2 BRAKE_MOTOR_IN1=BRAKE_MOTOR_IN1_U_ESC2 BRAKE_MOTOR_IN2=BRAKE_MOTOR_IN2_U_ESC2 CAN_RX=CAN_RX_U_ESC2 CAN_S=CAN_S_U_ESC2 CAN_TX=CAN_TX_U_ESC2 ENC_PWR_EN=ENC_PWR_EN_U_ESC2 EXT16=COMP_OUT_W_U_ESC2 EXT17=COMP_OUT_V_U_ESC2 EXT18=COMP_OUT_U_U_ESC2 PWM_H1=PWM_UH_U_ESC2 PWM_H2=PWM_VH_U_ESC2 PWM_H3=PWM_WH_U_ESC2 PWM_L1=PWM_UL_U_ESC2 PWM_L2=PWM_VL_U_ESC2 PWM_L3=PWM_WL_U_ESC2 SERVO=SERVO_U_ESC2
U_ESC3/U_ESC_MCU: designators end in _3; ports 3V3_IN=3V3_MCU_ESC_U_ESC3 ADC1_IN1=ISNS_W_U_ESC3 ADC1_IN14=ISNS_V_U_ESC3 ADC1_IN15=VSNS_W_U_ESC3 ADC2_IN4=VSNS_U_U_ESC3 ADC2_IN8=VSNS_V_U_ESC3 ADC2_IN10=ISNS_VIN_U_ESC3 ADC2_IN11=VSNS_ESC_U_ESC3 ADC2_IN13=VSNS_X_U_ESC3 BRAKE_MOTOR_IN1=BRAKE_MOTOR_IN1_U_ESC3 BRAKE_MOTOR_IN2=BRAKE_MOTOR_IN2_U_ESC3 CAN_RX=CAN_RX_U_ESC3 CAN_S=CAN_S_U_ESC3 CAN_TX=CAN_TX_U_ESC3 ENC_PWR_EN=ENC_PWR_EN_U_ESC3 EXT16=COMP_OUT_W_U_ESC3 EXT17=COMP_OUT_V_U_ESC3 EXT18=COMP_OUT_U_U_ESC3 PWM_H1=PWM_UH_U_ESC3 PWM_H2=PWM_VH_U_ESC3 PWM_H3=PWM_WH_U_ESC3 PWM_L1=PWM_UL_U_ESC3 PWM_L2=PWM_VL_U_ESC3 PWM_L3=PWM_WL_U_ESC3 SERVO=SERVO_U_ESC3

### Library data of the parts
C43_ESC C44_ESC C45_ESC C46_ESC C47_ESC C48_ESC C49_ESC C50_ESC C51_ESC = CAP_0402: CAP CER 402; Value: 0.1uF
D5_ESC D6_ESC = XZCDGK53W-8VF: LED GREEN CLEAR 2SMD; Manufacturer: SunLED; Configuration: Independent; Current - Test: 2mA; Lens Color: Colorless; Lens Size: 0.35mm Dia; Lens Style: Round with Domed Top; Millicandela Rating: 417mcd; Viewing Angle: 60°; Voltage - Forward (Vf) (Typ): 2.65V; Wavelength - Dominant: 525nm; Wavelength - Peak: 515nm; Part Number: XZCDGK53W-8VF; Color: Green; ComponentLink1Description: Datasheet; ComponentLink1URL: https://www.sunledusa.com/products/spec/XZCDGK53W-8VF.pdf; ComponentLink2Description: DigiKey Link; ComponentLink2URL: https://www.digikey.com/en/products/detail/sunled/XZCDGK53W-8VF/10449775; Device Package: 0603 (1608 Metric); Height (Max): 1.10mm; LastUpdated: 6/3/2024 7:58:52 PM; Lens Transparency: Clear; Lifecycle Status: Active; Minimum Order: 1; Mounting Type: Surface Mount; Package / Case: 0603 (1608 Metric); Packaging: TapeAndReel; PartId: 938; Part Status: Active; Price: 0.15; Series: Ultra Low Current; Size / Dimension: 1.60mm L x 0.80mm W; Supplier 1: DigiKey; Supplier Part Number 1: 1497-XZCDGK53W-8VFCT-ND; Supplier Device Package: 2-SMD; Value: Green
J4_ESC = BM07B-SRSS-TB(LF)(SN): CONN HEADER SMD 7POS 1MM; Manufacturer: JST Sales America Inc.; Current Rating (Amps): 0.7A; Material Flammability Rating: UL94 V-0; Number of Positions: 7; Number of Positions Loaded: All; Pitch - Mating: 0.039" (1.00mm); Shrouding: Shrouded - 4 Wall; Style: Board to Cable/Wire; Voltage Rating: 50V; Part Number: BM07B-SRSS-TB(LF)(SN); ComponentLink1Description: Datasheet; ComponentLink1URL: http://www.jst-mfg.com/product/pdf/eng/eSH.pdf; ComponentLink2Description: DigiKey Link; ComponentLink2URL: http://digikey.com/product-detail/en/jst-sales-america-inc/BM07B-SRSS-TB-LF-SN/455-1793-1-ND/926864; Connector Type: Header; Contact Finish - Mating: Tin; Contact Finish - Post: Tin; Contact Material: Copper Alloy; Contact Shape: Square; Contact Type: Male Pin; Fastening Type: Push-Pull; Features: Solder Retention; Insulation Color: Natural; Insulation Height: 0.167" (4.25mm); Insulation Material: Polyamide (PA), Nylon; LastUpdated: 1/12/2020 10:15:04 PM; Lifecycle Status: Active; Minimum Order: 1; Mounting Type: Surface Mount; Number of Rows: 1; Operating Temperature: -25°C ~ 85°C; Packaging: TapeAndReel; PartId: 22; Part Status: Active; Price: 0.42; Series: SR; Supplier 1: DigiKey; Supplier Part Number 1: 455-1793-1-ND; Termination: Solder
R33_ESC R34_ESC R35_ESC = RES_0402: RES 0402
Y1_ESC = ASD3-27.000MHZ-EC-T: XTAL OSC XO 27.0000MHZ HCMOS SMD; Manufacturer: Abracon LLC; Base Resonator: Crystal; Current - Supply (Max): 4mA; Frequency Stability: ±50ppm; Function: Enable/Disable; Voltage - Supply: 1.8V; Part Number: ASD3-27.000MHZ-EC-T; ComponentLink1Description: Datasheet; ComponentLink1URL: https://abracon.com/Oscillators/ASDseries.pdf; ComponentLink2Description: DigiKey Link; ComponentLink2URL: http://digikey.com/product-detail/en/abracon-llc/ASD3-27.000MHZ-EC-T/535-9608-1-ND/1237075; Frequency: 27MHz; Height - Seated (Max): 0.039" (1.00mm); LastUpdated: 6/3/2024 8:02:05 PM; Lifecycle Status: Active; Minimum Order: 1; Mounting Type: Surface Mount; Operating Temperature: -20°C ~ 70°C; Output: HCMOS; Package / Case: 4-SMD, No Lead; Packaging: TapeAndReel; PartId: 4; Part Status: Active; Price: 1.74; Series: ASD; Size / Dimension: 0.098" L x 0.079" W (2.50mm x 2.00mm); Supplier 1: DigiKey; Supplier Part Number 1: 535-9608-1-ND; Type: XO (Standard); Value: 27MHz

## Sheet ESC_Power.SchDoc
size B; DocumentNumber: 4; SheetNumber: 6; SheetTotal: 7
Used 3 times, as channels U_ESC1/U_Power, U_ESC2/U_Power, U_ESC3/U_Power. Parts and nets are listed once, with the designators drawn on the sheet.
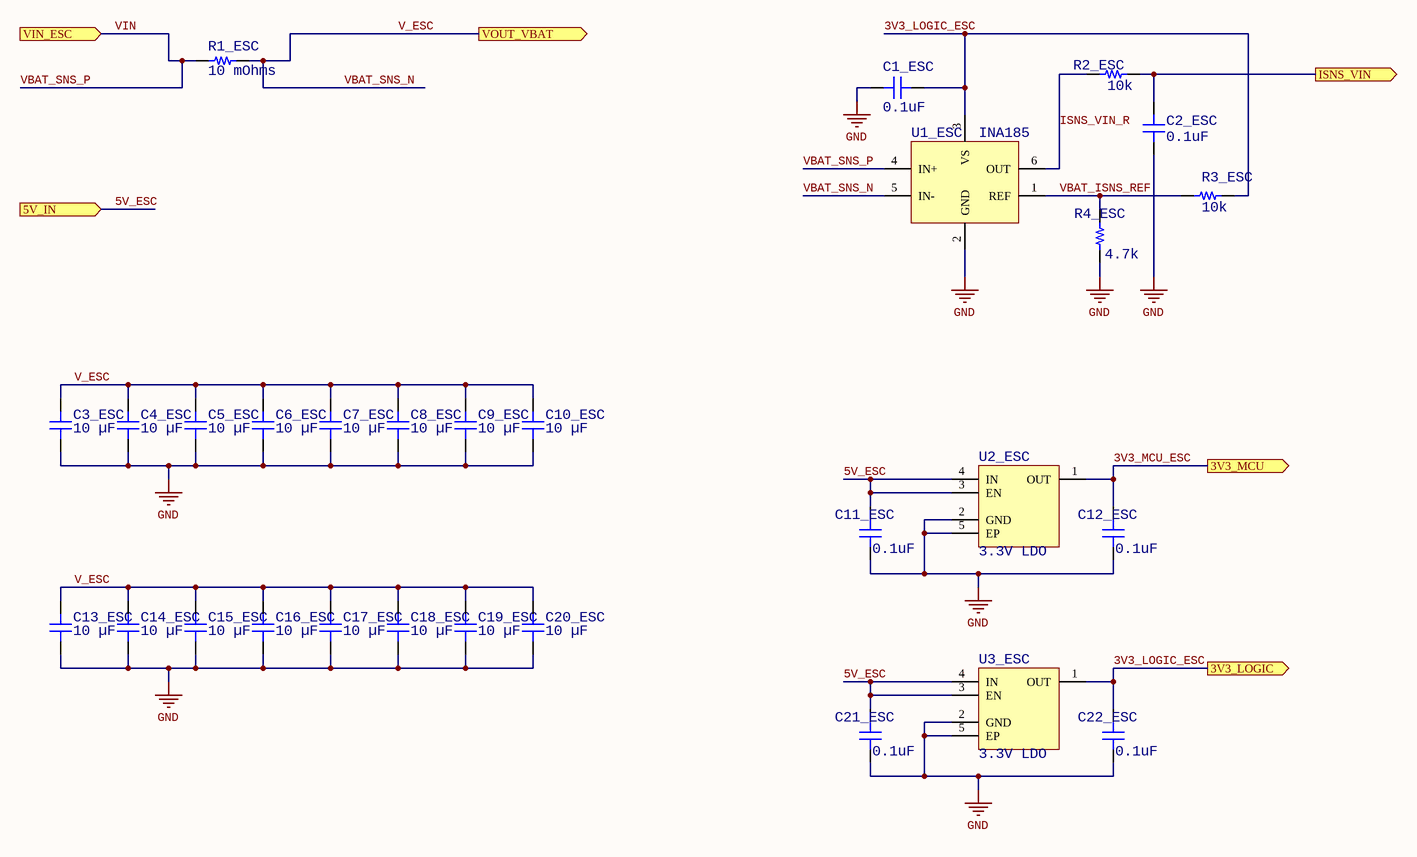
[diagram p3: ESC_Power.SchDoc]

### Parts
C1_ESC  0.1uF  [CAP_0402]
C2_ESC  0.1uF  [CAP_0402]
C3_ESC  10 µF  [CAP 1206_3216 - 0.8MM]
C4_ESC  10 µF  [CAP 1206_3216 - 0.8MM]
C5_ESC  10 µF  [CAP 1206_3216 - 0.8MM]
C6_ESC  10 µF  [CAP 1206_3216 - 0.8MM]
C7_ESC  10 µF  [CAP 1206_3216 - 0.8MM]
C8_ESC  10 µF  [CAP 1206_3216 - 0.8MM]
C9_ESC  10 µF  [CAP 1206_3216 - 0.8MM]
C10_ESC  10 µF  [CAP 1206_3216 - 0.8MM]
C11_ESC  0.1uF  [CAP_0402]
C12_ESC  0.1uF  [CAP_0402]
C13_ESC  10 µF  [CAP 1206_3216 - 0.8MM]
C14_ESC  10 µF  [CAP 1206_3216 - 0.8MM]
C15_ESC  10 µF  [CAP 1206_3216 - 0.8MM]
C16_ESC  10 µF  [CAP 1206_3216 - 0.8MM]
C17_ESC  10 µF  [CAP 1206_3216 - 0.8MM]
C18_ESC  10 µF  [CAP 1206_3216 - 0.8MM]
C19_ESC  10 µF  [CAP 1206_3216 - 0.8MM]
C20_ESC  10 µF  [CAP 1206_3216 - 0.8MM]
C21_ESC  0.1uF  [CAP_0402]
C22_ESC  0.1uF  [CAP_0402]
R1_ESC  10 mOhms  [RES 1206_3216]
R2_ESC  10k  [RES_0402]
R3_ESC  10k  [RES_0402]
R4_ESC  4.7k  [RES_0402]
U1_ESC  INA185  [TI SC70-6 DCK]
U2_ESC  3.3V LDO  [XDFN-4]
U3_ESC  3.3V LDO  [XDFN-4]

### Ports
3V3_LOGIC (out), 3V3_MCU (out), 5V_IN (in), ISNS_VIN (out), VIN_ESC (in), VOUT_VBAT (out)

### Nets
GND: C1_ESC.2 C2_ESC.2 C3_ESC.1 C4_ESC.1 C5_ESC.1 C6_ESC.1 C7_ESC.1 C8_ESC.1 C9_ESC.1 C10_ESC.1 C11_ESC.1 C12_ESC.1 C13_ESC.1 C14_ESC.1 C15_ESC.1 C16_ESC.1 C17_ESC.1 C18_ESC.1 C19_ESC.1 C20_ESC.1 C21_ESC.1 C22_ESC.1 R4_ESC.2 U1_ESC.2(GND) U2_ESC.2(GND) U2_ESC.5(EP) U3_ESC.2(GND) U3_ESC.5(EP)
3V3_LOGIC_ESC: C1_ESC.1 C22_ESC.2 R3_ESC.1 U1_ESC.3(VS) U3_ESC.1(OUT) ; port 3V3_LOGIC
3V3_MCU_ESC: C12_ESC.2 U2_ESC.1(OUT) ; port 3V3_MCU
5V_ESC: C11_ESC.2 C21_ESC.2 U2_ESC.3(EN) U2_ESC.4(IN) U3_ESC.3(EN) U3_ESC.4(IN) ; port 5V_IN
ISNS_VIN: C2_ESC.1 R2_ESC.1 ; port ISNS_VIN
ISNS_VIN_R: R2_ESC.2 U1_ESC.6(OUT)
V_ESC: C3_ESC.2 C4_ESC.2 C5_ESC.2 C6_ESC.2 C7_ESC.2 C8_ESC.2 C9_ESC.2 C10_ESC.2 C13_ESC.2 C14_ESC.2 C15_ESC.2 C16_ESC.2 C17_ESC.2 C18_ESC.2 C19_ESC.2 C20_ESC.2 R1_ESC.2 U1_ESC.5(IN-) ; port VOUT_VBAT  [also labelled VBAT_SNS_N]
VBAT_ISNS_REF: R3_ESC.2 R4_ESC.1 U1_ESC.1(REF)
VBAT_SNS_P: R1_ESC.1 U1_ESC.4(IN+) ; port VIN_ESC  [also labelled VIN]

### Channels
U_ESC1/U_Power: designators end in _1; ports 3V3_LOGIC=3V3_LOGIC_ESC_U_ESC1 3V3_MCU=3V3_MCU_ESC_U_ESC1 5V_IN=5V ISNS_VIN=ISNS_VIN_U_ESC1 VIN_ESC=VBAT VOUT_VBAT=V_ESC_U_ESC1
U_ESC2/U_Power: designators end in _2; ports 3V3_LOGIC=3V3_LOGIC_ESC_U_ESC2 3V3_MCU=3V3_MCU_ESC_U_ESC2 5V_IN=5V ISNS_VIN=ISNS_VIN_U_ESC2 VIN_ESC=VBAT VOUT_VBAT=V_ESC_U_ESC2
U_ESC3/U_Power: designators end in _3; ports 3V3_LOGIC=3V3_LOGIC_ESC_U_ESC3 3V3_MCU=3V3_MCU_ESC_U_ESC3 5V_IN=5V ISNS_VIN=ISNS_VIN_U_ESC3 VIN_ESC=VBAT VOUT_VBAT=V_ESC_U_ESC3

### Library data of the parts
C1_ESC C2_ESC C11_ESC C12_ESC C21_ESC C22_ESC = CAP_0402: CAP CER 402; Value: 0.1uF
C3_ESC C4_ESC C5_ESC C6_ESC C7_ESC C8_ESC C9_ESC C10_ESC C13_ESC C14_ESC C15_ESC C16_ESC C17_ESC C18_ESC C19_ESC C20_ESC = CL31X106KAHNNNE: CAP CER 10UF 25V X6S 1206; manufacturer: Samsung Electro-Mechanics; Tolerance: ±10%; Part Number: CL31X106KAHNNNE; Value: 10 µF; Applications: General Purpose; Capacitance: 10 µF; componentlink1description: Datasheet; componentlink1url: http://www.samsungsem.com/kr/support/product-search/mlcc/CL31X106KAHNNNE.jsp; componentlink2description: DigiKey Link; componentlink2url: https://www.digikey.com/en/products/detail/samsung-electro-mechanics/CL31X106KAHNNNE/3888956; Device Package: 1206 (3216 Metric); lastupdated: 6/4/2024 7:10:40 PM; Lifecycle Status: Active; Minimum Order: 1; Mounting Type: Surface Mount, MLCC; Operating Temperature: -55°C ~ 105°C; Package / Case: 1206 (3216 Metric); packaging: TapeAndReel; partid: 20108; Part Status: Active; price: 0.05; series: CL; Size / Dimension: 0.126" L x 0.063" W (3.20mm x 1.60mm); Supplier 1: DigiKey; Supplier Part Number 1: 1276-3298-1-ND; Temperature Coefficient: X6S; Thickness (Max): 0.071" (1.80mm); Voltage - Rated: 25V
R1_ESC = KRL1632E-M-R039-F-T5: RES 0.039 OHM 1% 3/4W 1206; Manufacturer: Susumu; Power (Watts): 0.75W, 3/4W; Resistance: 39 mOhms; Temperature Coefficient: ±50ppm/°C; Value: 39 mOhms; Part Number: KRL1632E-M-R039-F-T5; ComponentLink1Description: Datasheet; ComponentLink1URL: http://www.susumu.co.jp/common/pdf/n_catalog_partition09_en.pdf; ComponentLink2Description: DigiKey Link; ComponentLink2URL: https://www.digikey.com/en/products/detail/susumu/KRL1632E-M-R039-F-T5/3738003; Composition: Metal Foil; Device Package: 1206 (3216 Metric); Features: Automotive AEC-Q200, Current Sense; Height - Seated (Max): 0.028" (0.70mm); LastUpdated: 2/9/2024 8:54:46 PM; Lifecycle Status: Active; Minimum Order: 1; Number of Terminations: 2; Operating Temperature: -55°C ~ 155°C; Package / Case: 1206 (3216 Metric); Packaging: TapeAndReel; PartId: 26838; Part Status: Active; Price: 0.09; Ratings: AEC-Q200; Series: KRL; Size / Dimension: 0.126" L x 0.063" W (3.20mm x 1.60mm); Supplier 1: DigiKey; Supplier Part Number 1: 408-1577-1-ND; Supplier Device Package: 1206; Tolerance: ±1%
R2_ESC R3_ESC R4_ESC = RES_0402: RES 0402
U1_ESC = INA185: INA185A2
U2_ESC U3_ESC = TLV74033PDQNR

## Sheet Half_Bridges.SchDoc
size B; DocumentNumber: 6; SheetNumber: 7; SheetTotal: 7
Used 3 times, as channels U_ESC1/U_Half_Bridges, U_ESC2/U_Half_Bridges, U_ESC3/U_Half_Bridges. Parts and nets are listed once, with the designators drawn on the sheet.
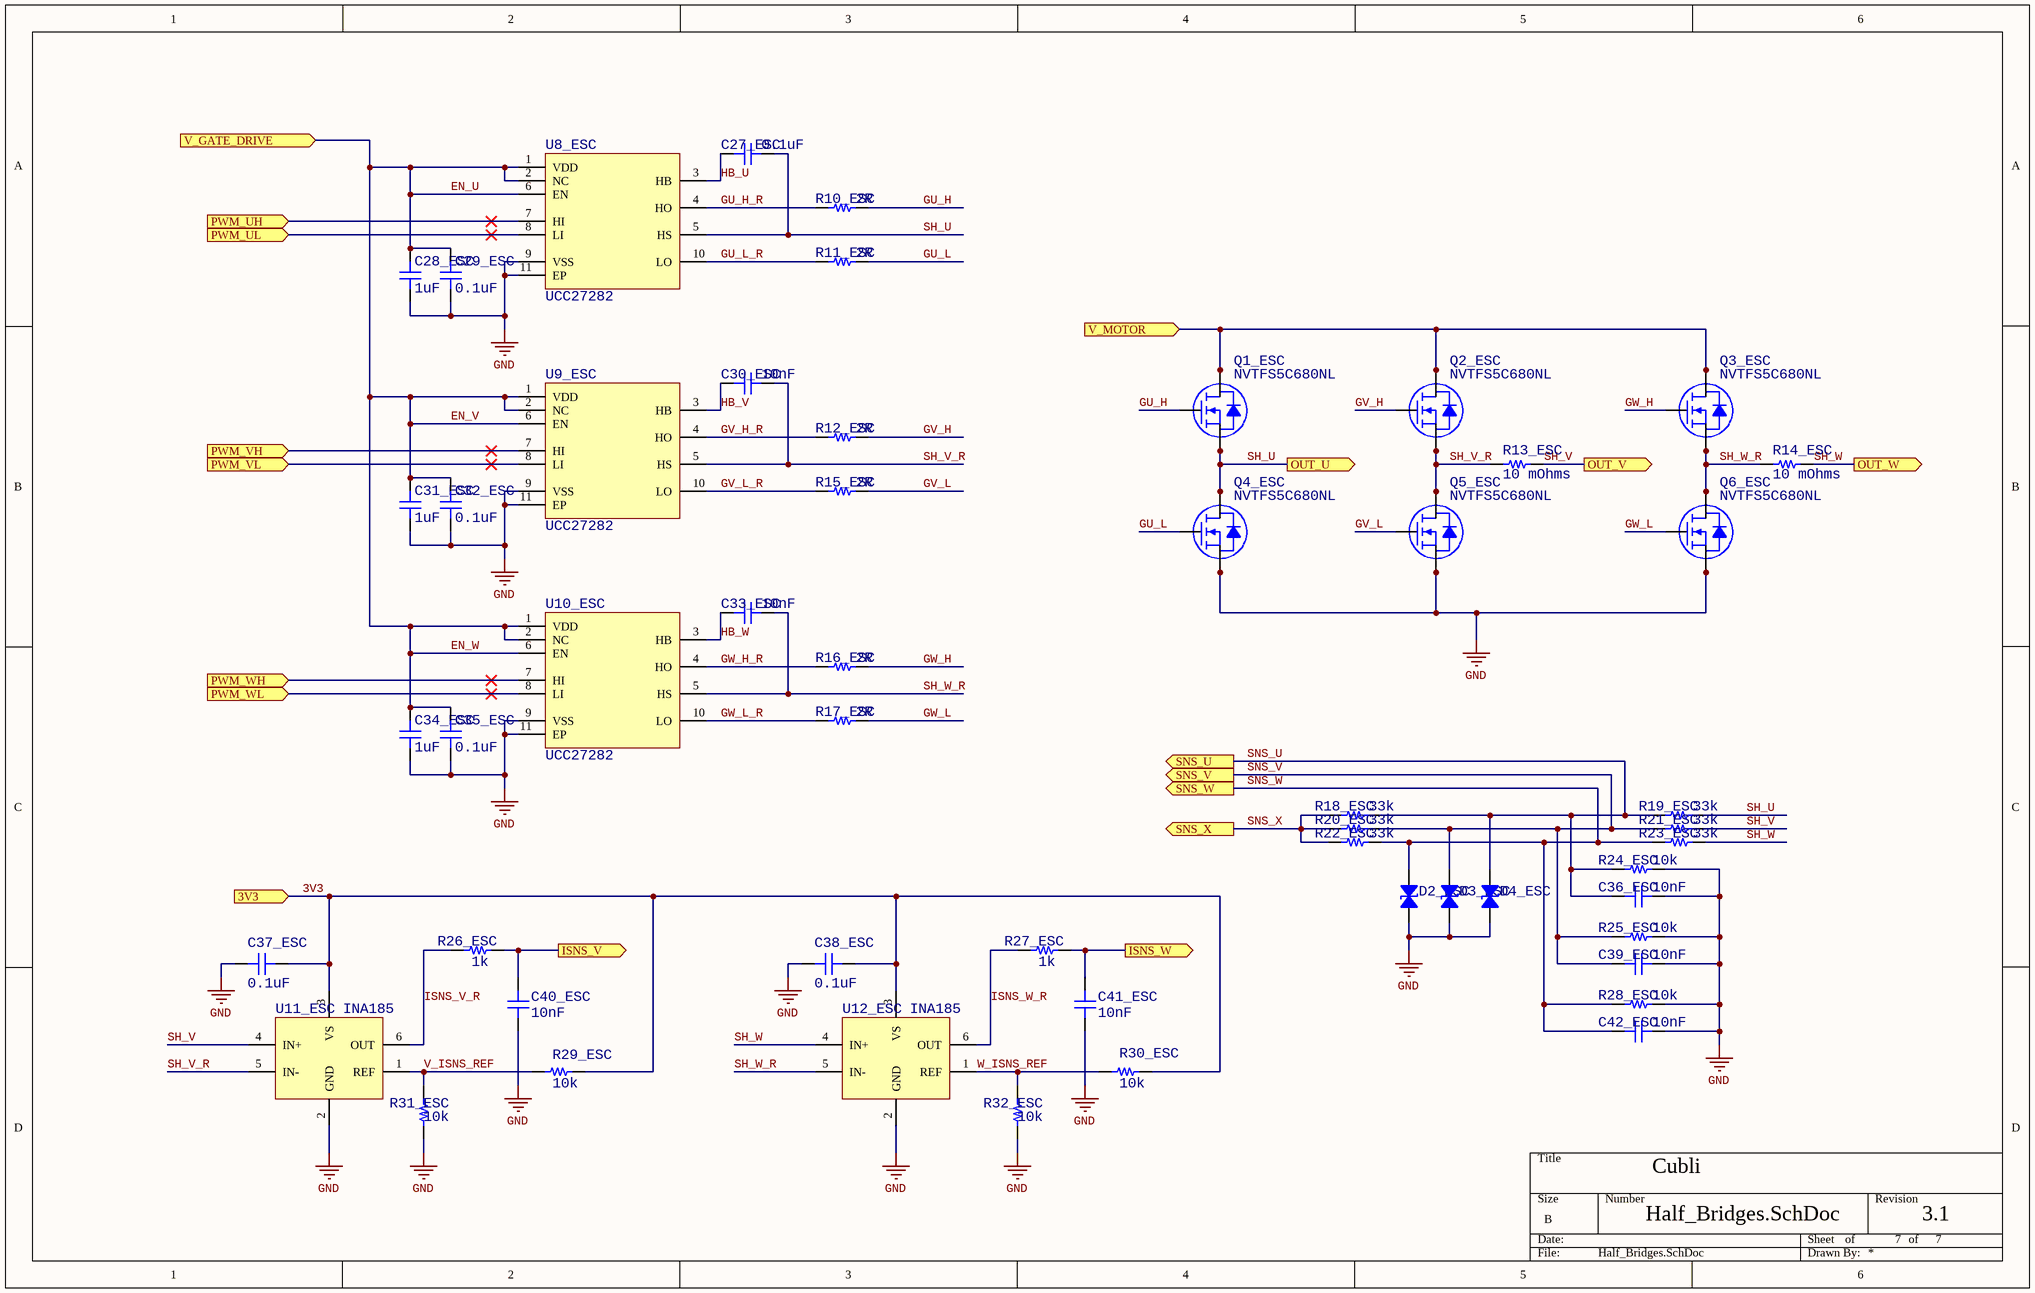
[diagram p4: Half_Bridges.SchDoc]

### Parts
C27_ESC  0.1uF  [CAP_0402]
C28_ESC  1uF  [CAP_0402]
C29_ESC  0.1uF  [CAP_0402]
C30_ESC  10nF  [CAP_0402]
C31_ESC  1uF  [CAP_0402]
C32_ESC  0.1uF  [CAP_0402]
C33_ESC  10nF  [CAP_0402]
C34_ESC  1uF  [CAP_0402]
C35_ESC  0.1uF  [CAP_0402]
C36_ESC  10nF  [CAP_0402]
C37_ESC  0.1uF  [CAP_0402]
C38_ESC  0.1uF  [CAP_0402]
C39_ESC  10nF  [CAP_0402]
C40_ESC  10nF  [CAP_0402]
C41_ESC  10nF  [CAP_0402]
C42_ESC  10nF  [CAP_0402]
D2_ESC  TVN3V3B1S-DFN1006-2LDG  [0402]  (value not drawn)
D3_ESC  TVN3V3B1S-DFN1006-2LDG  [0402]  (value not drawn)
D4_ESC  TVN3V3B1S-DFN1006-2LDG  [0402]  (value not drawn)
Q1_ESC  NVTFS5C680NL  [NVTFS015N04CTAG]
Q2_ESC  NVTFS5C680NL  [NVTFS015N04CTAG]
Q3_ESC  NVTFS5C680NL  [NVTFS015N04CTAG]
Q4_ESC  NVTFS5C680NL  [NVTFS015N04CTAG]
Q5_ESC  NVTFS5C680NL  [NVTFS015N04CTAG]
Q6_ESC  NVTFS5C680NL  [NVTFS015N04CTAG]
R10_ESC  2R  [RES_0402]
R11_ESC  2R  [RES_0402]
R12_ESC  2R  [RES_0402]
R13_ESC  10 mOhms  [RES 1206_3216]
R14_ESC  10 mOhms  [RES 1206_3216]
R15_ESC  2R  [RES_0402]
R16_ESC  2R  [RES_0402]
R17_ESC  2R  [RES_0402]
R18_ESC  33k  [RES_0402]
R19_ESC  33k  [RES_0402]
R20_ESC  33k  [RES_0402]
R21_ESC  33k  [RES_0402]
R22_ESC  33k  [RES_0402]
R23_ESC  33k  [RES_0402]
R24_ESC  10k  [RES_0402]
R25_ESC  10k  [RES_0402]
R26_ESC  1k  [RES_0402]
R27_ESC  1k  [RES_0402]
R28_ESC  10k  [RES_0402]
R29_ESC  10k  [RES_0402]
R30_ESC  10k  [RES_0402]
R31_ESC  10k  [RES_0402]
R32_ESC  10k  [RES_0402]
U8_ESC  UCC27282  [VSON-10]
U9_ESC  UCC27282  [VSON-10]
U10_ESC  UCC27282  [VSON-10]
U11_ESC  INA185  [TI SC70-6 DCK]
U12_ESC  INA185  [TI SC70-6 DCK]

### Ports
3V3 (in), ISNS_V (out), ISNS_W (out), OUT_U (out), OUT_V (out), OUT_W (out), PWM_UH (in), PWM_UL (in), PWM_VH (in), PWM_VL (in), PWM_WH (in), PWM_WL (in), SNS_U (out), SNS_V (out), SNS_W (out), SNS_X (out), V_GATE_DRIVE (in), V_MOTOR (in)

### Nets
GND: C28_ESC.2 C29_ESC.2 C31_ESC.2 C32_ESC.2 C34_ESC.2 C35_ESC.2 C36_ESC.1 C37_ESC.2 C38_ESC.2 C39_ESC.1 C40_ESC.2 C41_ESC.2 C42_ESC.1 D2_ESC.1 D3_ESC.1 D4_ESC.1 Q4_ESC.1(S) Q4_ESC.2(S) Q4_ESC.3(S) Q5_ESC.1(S) Q5_ESC.2(S) Q5_ESC.3(S) Q6_ESC.1(S) Q6_ESC.2(S) Q6_ESC.3(S) R24_ESC.2 R25_ESC.2 R28_ESC.2 R31_ESC.2 R32_ESC.2 U8_ESC.9(VSS) U8_ESC.11(EP) U9_ESC.9(VSS) U9_ESC.11(EP) U10_ESC.9(VSS) U10_ESC.11(EP) U11_ESC.2(GND) U12_ESC.2(GND)
3V3: C37_ESC.1 C38_ESC.1 R29_ESC.1 R30_ESC.1 U11_ESC.3(VS) U12_ESC.3(VS) ; port 3V3
EN_U: C28_ESC.1 C29_ESC.1 C31_ESC.1 C32_ESC.1 C34_ESC.1 C35_ESC.1 U8_ESC.1(VDD) U8_ESC.2(NC) U8_ESC.6(EN) U9_ESC.1(VDD) U9_ESC.2(NC) U9_ESC.6(EN) U10_ESC.1(VDD) U10_ESC.2(NC) U10_ESC.6(EN) ; port V_GATE_DRIVE  [also labelled EN_V, EN_W]
GU_H: Q1_ESC.4(G) R10_ESC.2
GU_H_R: R10_ESC.1 U8_ESC.4(HO)
GU_L: Q4_ESC.4(G) R11_ESC.2
GU_L_R: R11_ESC.1 U8_ESC.10(LO)
GV_H: Q2_ESC.4(G) R12_ESC.2
GV_H_R: R12_ESC.1 U9_ESC.4(HO)
GV_L: Q5_ESC.4(G) R15_ESC.2
GV_L_R: R15_ESC.1 U9_ESC.10(LO)
GW_H: Q3_ESC.4(G) R16_ESC.2
GW_H_R: R16_ESC.1 U10_ESC.4(HO)
GW_L: Q6_ESC.4(G) R17_ESC.2
GW_L_R: R17_ESC.1 U10_ESC.10(LO)
HB_U: C27_ESC.2 U8_ESC.3(HB)
HB_V: C30_ESC.2 U9_ESC.3(HB)
HB_W: C33_ESC.2 U10_ESC.3(HB)
ISNS_V: C40_ESC.1 R26_ESC.1 ; port ISNS_V
ISNS_V_R: R26_ESC.2 U11_ESC.6(OUT)
ISNS_W: C41_ESC.1 R27_ESC.1 ; port ISNS_W
ISNS_W_R: R27_ESC.2 U12_ESC.6(OUT)
PWM_UH: U8_ESC.7(HI) ; port PWM_UH
PWM_UL: U8_ESC.8(LI) ; port PWM_UL
PWM_VH: U9_ESC.7(HI) ; port PWM_VH
PWM_VL: U9_ESC.8(LI) ; port PWM_VL
PWM_WH: U10_ESC.7(HI) ; port PWM_WH
PWM_WL: U10_ESC.8(LI) ; port PWM_WL
SH_U: C27_ESC.1 Q1_ESC.1(S) Q1_ESC.2(S) Q1_ESC.3(S) Q4_ESC.5(D) Q4_ESC.6(D) Q4_ESC.7(D) Q4_ESC.8(D) R19_ESC.1 U8_ESC.5(HS) ; port OUT_U
SH_V: R13_ESC.2 R21_ESC.1 U11_ESC.4(IN+) ; port OUT_V
SH_V_R: C30_ESC.1 Q2_ESC.1(S) Q2_ESC.2(S) Q2_ESC.3(S) Q5_ESC.5(D) Q5_ESC.6(D) Q5_ESC.7(D) Q5_ESC.8(D) R13_ESC.1 U9_ESC.5(HS) U11_ESC.5(IN-)
SH_W: R14_ESC.2 R23_ESC.1 U12_ESC.4(IN+) ; port OUT_W
SH_W_R: C33_ESC.1 Q3_ESC.1(S) Q3_ESC.2(S) Q3_ESC.3(S) Q6_ESC.5(D) Q6_ESC.6(D) Q6_ESC.7(D) Q6_ESC.8(D) R14_ESC.1 U10_ESC.5(HS) U12_ESC.5(IN-)
SNS_U: C36_ESC.2 D4_ESC.2 R18_ESC.1 R19_ESC.2 R24_ESC.1 ; port SNS_U
SNS_V: C39_ESC.2 D3_ESC.2 R20_ESC.1 R21_ESC.2 R25_ESC.1 ; port SNS_V
SNS_W: C42_ESC.2 D2_ESC.2 R22_ESC.1 R23_ESC.2 R28_ESC.1 ; port SNS_W
SNS_X: R18_ESC.2 R20_ESC.2 R22_ESC.2 ; port SNS_X
V_ISNS_REF: R29_ESC.2 R31_ESC.1 U11_ESC.1(REF)
V_MOTOR: Q1_ESC.5(D) Q1_ESC.6(D) Q1_ESC.7(D) Q1_ESC.8(D) Q2_ESC.5(D) Q2_ESC.6(D) Q2_ESC.7(D) Q2_ESC.8(D) Q3_ESC.5(D) Q3_ESC.6(D) Q3_ESC.7(D) Q3_ESC.8(D) ; port V_MOTOR
W_ISNS_REF: R30_ESC.2 R32_ESC.1 U12_ESC.1(REF)

### Channels
U_ESC1/U_Half_Bridges: designators end in _1; ports 3V3=3V3_LOGIC_ESC_U_ESC1 ISNS_V=ISNS_V_U_ESC1 ISNS_W=ISNS_W_U_ESC1 OUT_U=OUT_U_U_ESC1 OUT_V=OUT_V_U_ESC1 OUT_W=OUT_W_U_ESC1 PWM_UH=PWM_UH_U_ESC1 PWM_UL=PWM_UL_U_ESC1 PWM_VH=PWM_VH_U_ESC1 PWM_VL=PWM_VL_U_ESC1 PWM_WH=PWM_WH_U_ESC1 PWM_WL=PWM_WL_U_ESC1 SNS_U=VSNS_U_U_ESC1 SNS_V=VSNS_V_U_ESC1 SNS_W=VSNS_W_U_ESC1 SNS_X=VSNS_X_U_ESC1 V_GATE_DRIVE=12V V_MOTOR=V_ESC_U_ESC1
U_ESC2/U_Half_Bridges: designators end in _2; ports 3V3=3V3_LOGIC_ESC_U_ESC2 ISNS_V=ISNS_V_U_ESC2 ISNS_W=ISNS_W_U_ESC2 OUT_U=OUT_U_U_ESC2 OUT_V=OUT_V_U_ESC2 OUT_W=OUT_W_U_ESC2 PWM_UH=PWM_UH_U_ESC2 PWM_UL=PWM_UL_U_ESC2 PWM_VH=PWM_VH_U_ESC2 PWM_VL=PWM_VL_U_ESC2 PWM_WH=PWM_WH_U_ESC2 PWM_WL=PWM_WL_U_ESC2 SNS_U=VSNS_U_U_ESC2 SNS_V=VSNS_V_U_ESC2 SNS_W=VSNS_W_U_ESC2 SNS_X=VSNS_X_U_ESC2 V_GATE_DRIVE=12V V_MOTOR=V_ESC_U_ESC2
U_ESC3/U_Half_Bridges: designators end in _3; ports 3V3=3V3_LOGIC_ESC_U_ESC3 ISNS_V=ISNS_V_U_ESC3 ISNS_W=ISNS_W_U_ESC3 OUT_U=OUT_U_U_ESC3 OUT_V=OUT_V_U_ESC3 OUT_W=OUT_W_U_ESC3 PWM_UH=PWM_UH_U_ESC3 PWM_UL=PWM_UL_U_ESC3 PWM_VH=PWM_VH_U_ESC3 PWM_VL=PWM_VL_U_ESC3 PWM_WH=PWM_WH_U_ESC3 PWM_WL=PWM_WL_U_ESC3 SNS_U=VSNS_U_U_ESC3 SNS_V=VSNS_V_U_ESC3 SNS_W=VSNS_W_U_ESC3 SNS_X=VSNS_X_U_ESC3 V_GATE_DRIVE=12V V_MOTOR=V_ESC_U_ESC3

### Notes on the sheet
- of

### Library data of the parts
C27_ESC C28_ESC C29_ESC C30_ESC C31_ESC C32_ESC C33_ESC C34_ESC C35_ESC C36_ESC C37_ESC C38_ESC C39_ESC C40_ESC C41_ESC C42_ESC = CAP_0402: CAP CER 402
  C27_ESC C29_ESC C32_ESC C35_ESC C37_ESC C38_ESC: Value: 0.1uF
  C28_ESC C31_ESC C34_ESC: Value: 1uF
  C30_ESC C33_ESC C36_ESC C39_ESC C40_ESC C41_ESC C42_ESC: Value: 10nF
D2_ESC D3_ESC D4_ESC = TVN3V3B1S-DFN1006-2LDG: as D1_ESC on sheet ESC; Part Number: TVN3V3B1S-DFN1006-2LDG; Applications: General Purpose; ComponentLink1Description: Datasheet; ComponentLink1URL: https://mm.digikey.com/Volume0/opasdata/d220001/medias/docus/5383/TVN3V3B1S-DFN1006-2LDG.pdf; ComponentLink2Description: DigiKey Link; ComponentLink2URL: https://www.digikey.com/en/products/detail/inpaq-technology-co-ltd/TVN3V3B1S-DFN1006-2LDG/20486686; Device Package: 0402 (1005 Metric); LastUpdated: 6/3/2024 8:22:57 PM; Lifecycle Status: Active; Minimum Order: 1; Mounting Type: Surface Mount; Operating Temperature: 150°C (TJ); Package / Case: 0402 (1005 Metric); Packaging: TapeAndReel; PartId: 11821; Price: 0.02; Series: TVN; Supplier 1: DigiKey; Supplier Part Number 1: 3526-TVN3V3B1S-DFN1006-2LDGCT-ND; Supplier Device Package: DFN1006
Q1_ESC Q2_ESC Q3_ESC Q4_ESC Q5_ESC Q6_ESC = NVTFS5C680NL: N-FET
R10_ESC R11_ESC R12_ESC R15_ESC R16_ESC R17_ESC R18_ESC R19_ESC R20_ESC R21_ESC R22_ESC R23_ESC R24_ESC R25_ESC R26_ESC R27_ESC R28_ESC R29_ESC R30_ESC R31_ESC R32_ESC = RES_0402: RES 0402
R13_ESC R14_ESC = KRL1632E-M-R039-F-T5: as R1_ESC on sheet ESC_Power; Part Number: KRL1632E-M-R039-F-T5; ComponentLink1Description: Datasheet; ComponentLink1URL: http://www.susumu.co.jp/common/pdf/n_catalog_partition09_en.pdf; ComponentLink2Description: DigiKey Link; ComponentLink2URL: https://www.digikey.com/en/products/detail/susumu/KRL1632E-M-R039-F-T5/3738003; Composition: Metal Foil; Device Package: 1206 (3216 Metric); Features: Automotive AEC-Q200, Current Sense; Height - Seated (Max): 0.028" (0.70mm); LastUpdated: 2/9/2024 8:54:46 PM; Lifecycle Status: Active; Minimum Order: 1; Number of Terminations: 2; Operating Temperature: -55°C ~ 155°C; Package / Case: 1206 (3216 Metric); Packaging: TapeAndReel; PartId: 26838; Part Status: Active; Price: 0.09; Ratings: AEC-Q200; Series: KRL; Size / Dimension: 0.126" L x 0.063" W (3.20mm x 1.60mm); Supplier 1: DigiKey; Supplier Part Number 1: 408-1577-1-ND; Supplier Device Package: 1206; Tolerance: ±1%
U8_ESC U9_ESC U10_ESC = UCC27282DRCR: 3-A, 120-V half bridge gate driver with 5-V UVLO, interlock and enable 10-VSON -40 to 125; MF: Texas Instruments; Texas_Instruments-Purchase-URL: https://snapeda.com/shop?store=Texas+Instruments&id=3625400; Price: None; Availability: Warning; Package: VSON-10 Texas Instruments; SnapEDA_Link: https://www.snapeda.com/parts/UCC27282DRCR/Texas%20Instruments/view-part/3625400/?ref=snap; DigiKey-Purchase-URL: https://snapeda.com/shop?store=DigiKey&id=3625400; MP: UCC27282DRCR; Value: *
U11_ESC U12_ESC = INA185: INA185A2

## Sheet Main_MCU.SchDoc
size B; DocumentNumber: 3; SheetNumber: 3; SheetTotal: 7
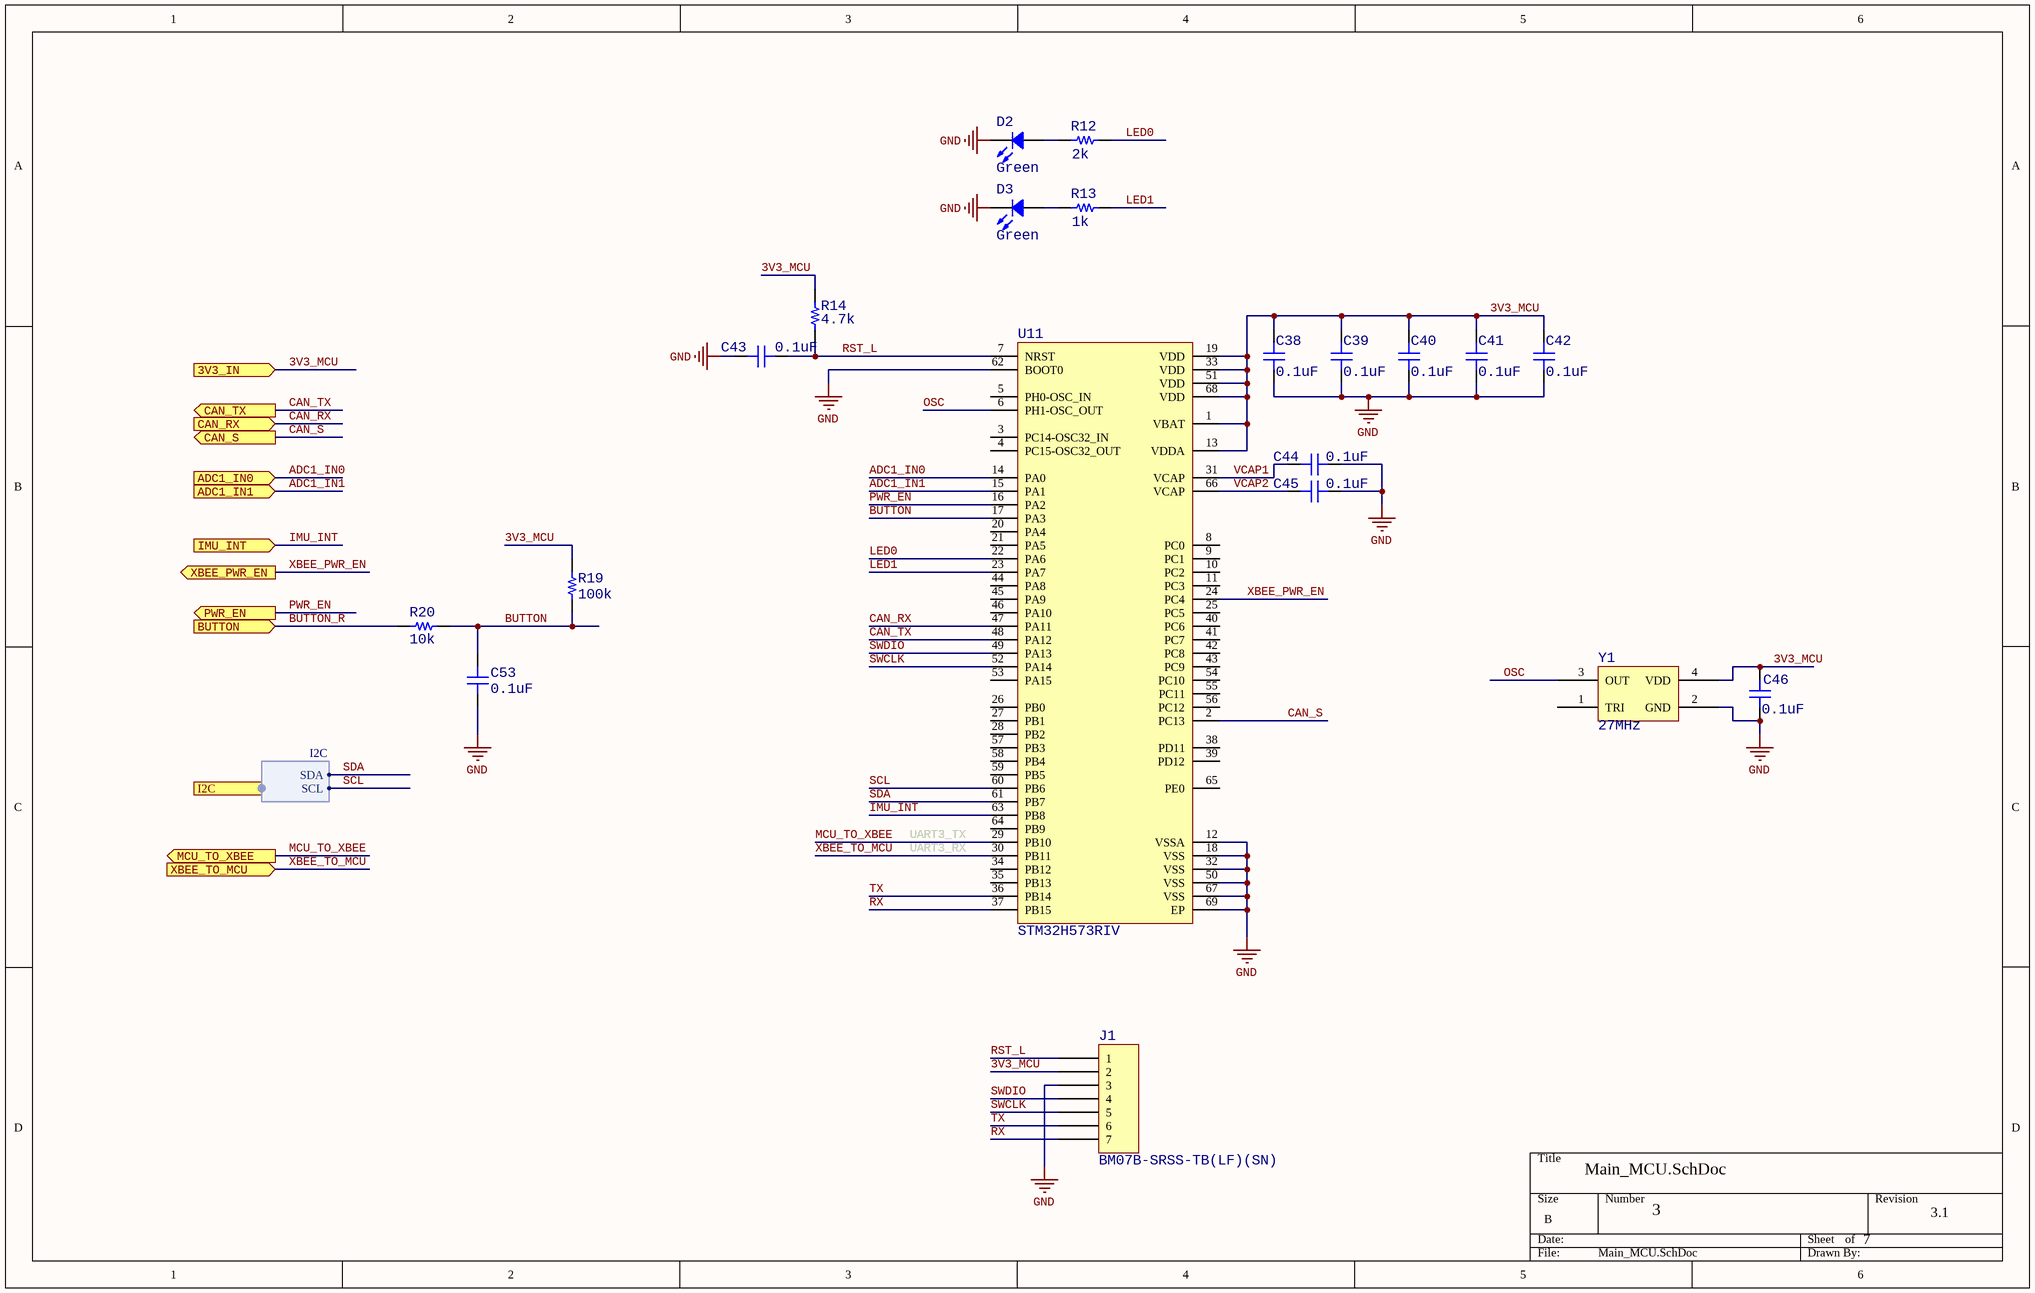
[diagram p5: Main_MCU.SchDoc]

### Parts
C38  0.1uF  [CAP_0402]
C39  0.1uF  [CAP_0402]
C40  0.1uF  [CAP_0402]
C41  0.1uF  [CAP_0402]
C42  0.1uF  [CAP_0402]
C43  0.1uF  [CAP_0402]
C44  0.1uF  [CAP_0402]
C45  0.1uF  [CAP_0402]
C46  0.1uF  [CAP_0402]
C53  0.1uF  [CAP_0402]
D2  Green  [LED 0603_1608 GREEN]
D3  Green  [LED 0603_1608 GREEN]
J1  BM07B-SRSS-TB(LF)(SN)  [JST BM07B-SRSS-TB]
R12  2k  [RES_0402]
R13  1k  [RES_0402]
R14  4.7k  [RES_0402]
R19  100k  [RES_0402]
R20  10k  [RES_0402]
U11  STM32H573RIV  [68-VFQFPN]
Y1  27MHz  [ABRACON ASD]

### Ports
3V3_IN (in), ADC1_IN0 (in), ADC1_IN1 (in), BUTTON (in), CAN_RX (in), CAN_S (out), CAN_TX (out), I2C (harness I2C), IMU_INT (in), MCU_TO_XBEE (out), PWR_EN (out), XBEE_PWR_EN (out), XBEE_TO_MCU (in)

### Harnesses
I2C: SDA, SCL

### Nets
3V3_MCU: C38.2 C39.2 C40.2 C41.2 C42.2 C46.2 J1.2 R14.2 R19.1 U11.1(VBAT) U11.13(VDDA) U11.19(VDD) U11.33(VDD) U11.51(VDD) U11.68(VDD) Y1.4(VDD) ; port 3V3_IN  [project net 3V3_MAIN]
GND: C38.1 C39.1 C40.1 C41.1 C42.1 C43.2 C44.1 C45.1 C46.1 C53.2 D2.2 D3.2 J1.3 U11.12(VSSA) U11.18(VSS) U11.32(VSS) U11.50(VSS) U11.62(BOOT0) U11.67(VSS) U11.69(EP) Y1.2(GND)
ADC1_IN0: U11.14(PA0) ; port ADC1_IN0  [project net VBAT_ISNS]
ADC1_IN1: U11.15(PA1) ; port ADC1_IN1  [project net VSNS_VBAT]
BUTTON: C53.1 R19.2 R20.1 U11.17(PA3)
BUTTON_R: R20.2 ; port BUTTON  [project net BUTTON_IN]
CAN_RX: U11.47(PA11) ; port CAN_RX
CAN_S: U11.2(PC13) ; port CAN_S
CAN_TX: U11.48(PA12) ; port CAN_TX
IMU_INT: U11.63(PB8) ; port IMU_INT
LED0: R12.2 U11.22(PA6)
LED1: R13.2 U11.23(PA7)
MCU_TO_XBEE: U11.29(PB10) ; port MCU_TO_XBEE
OSC: U11.6(PH1-OSC_OUT) Y1.3(OUT)
PWR_EN: U11.16(PA2) ; port PWR_EN
RST_L: C43.1 J1.1 R14.1 U11.7(NRST)
RX: J1.7 U11.37(PB15)
SCL: U11.60(PB6) ; port I2C.SCL  [project net I2C_MAIN.SCL]
SDA: U11.61(PB7) ; port I2C.SDA  [project net I2C_MAIN.SDA]
SWCLK: J1.5 U11.52(PA14)
SWDIO: J1.4 U11.49(PA13)
TX: J1.6 U11.36(PB14)
VCAP1: C44.2 U11.31(VCAP)
VCAP2: C45.2 U11.66(VCAP)
XBEE_PWR_EN: U11.24(PC4) ; port XBEE_PWR_EN
XBEE_TO_MCU: U11.30(PB11) ; port XBEE_TO_MCU
NetD2_1: D2.1 R12.1
NetD3_1: D3.1 R13.1

Not connected (* = marked no-connect by the designer): U11 3(PC14-OSC32_IN) 4(PC15-OSC32_OUT) 5(PH0-OSC_IN) 8(PC0) 9(PC1) 10(PC2) 11(PC3) 20(PA4) 21(PA5) 25(PC5) 26(PB0) 27(PB1) 28(PB2) 34(PB12) 35(PB13) 38(PD11) 39(PD12) 40(PC6) 41(PC7) 42(PC8) 43(PC9) 44(PA8) 45(PA9) 46(PA10) 53(PA15) 54(PC10) 55(PC11) 56(PC12) 57(PB3) 58(PB4) 59(PB5) 64(PB9) 65(PE0); Y1 1(TRI)

### Notes on the sheet
- UART3_TX
- UART3_RX

### Library data of the parts
C38-C46 C53 = CAP_0402: CAP CER 402; Value: 0.1uF
D2 D3 = XZCDGK53W-8VF: as D5_ESC on sheet ESC_MCU; Part Number: XZCDGK53W-8VF; Color: Green; ComponentLink1Description: Datasheet; ComponentLink1URL: https://www.sunledusa.com/products/spec/XZCDGK53W-8VF.pdf; ComponentLink2Description: DigiKey Link; ComponentLink2URL: https://www.digikey.com/en/products/detail/sunled/XZCDGK53W-8VF/10449775; Device Package: 0603 (1608 Metric); Height (Max): 1.10mm; LastUpdated: 6/3/2024 7:58:52 PM; Lens Transparency: Clear; Lifecycle Status: Active; Minimum Order: 1; Mounting Type: Surface Mount; Package / Case: 0603 (1608 Metric); Packaging: TapeAndReel; PartId: 938; Part Status: Active; Price: 0.15; Series: Ultra Low Current; Size / Dimension: 1.60mm L x 0.80mm W; Supplier 1: DigiKey; Supplier Part Number 1: 1497-XZCDGK53W-8VFCT-ND; Supplier Device Package: 2-SMD; Value: Green
J1 = BM07B-SRSS-TB(LF)(SN): as J4_ESC on sheet ESC_MCU; Part Number: BM07B-SRSS-TB(LF)(SN); ComponentLink1Description: Datasheet; ComponentLink1URL: http://www.jst-mfg.com/product/pdf/eng/eSH.pdf; ComponentLink2Description: DigiKey Link; ComponentLink2URL: http://digikey.com/product-detail/en/jst-sales-america-inc/BM07B-SRSS-TB-LF-SN/455-1793-1-ND/926864; Connector Type: Header; Contact Finish - Mating: Tin; Contact Finish - Post: Tin; Contact Material: Copper Alloy; Contact Shape: Square; Contact Type: Male Pin; Fastening Type: Push-Pull; Features: Solder Retention; Insulation Color: Natural; Insulation Height: 0.167" (4.25mm); Insulation Material: Polyamide (PA), Nylon; LastUpdated: 1/12/2020 10:15:04 PM; Lifecycle Status: Active; Minimum Order: 1; Mounting Type: Surface Mount; Number of Rows: 1; Operating Temperature: -25°C ~ 85°C; Packaging: TapeAndReel; PartId: 22; Part Status: Active; Price: 0.42; Series: SR; Supplier 1: DigiKey; Supplier Part Number 1: 455-1793-1-ND; Termination: Solder
R12-R14 R19 R20 = RES_0402: RES 0402
Y1 = ASD3-27.000MHZ-EC-T: as Y1_ESC on sheet ESC_MCU; Part Number: ASD3-27.000MHZ-EC-T; ComponentLink1Description: Datasheet; ComponentLink1URL: https://abracon.com/Oscillators/ASDseries.pdf; ComponentLink2Description: DigiKey Link; ComponentLink2URL: http://digikey.com/product-detail/en/abracon-llc/ASD3-27.000MHZ-EC-T/535-9608-1-ND/1237075; Frequency: 27MHz; Height - Seated (Max): 0.039" (1.00mm); LastUpdated: 6/3/2024 8:02:05 PM; Lifecycle Status: Active; Minimum Order: 1; Mounting Type: Surface Mount; Operating Temperature: -20°C ~ 70°C; Output: HCMOS; Package / Case: 4-SMD, No Lead; Packaging: TapeAndReel; PartId: 4; Part Status: Active; Price: 1.74; Series: ASD; Size / Dimension: 0.098" L x 0.079" W (2.50mm x 2.00mm); Supplier 1: DigiKey; Supplier Part Number 1: 535-9608-1-ND; Type: XO (Standard); Value: 27MHz